# EAGLE schematic RetroLite Rev 1.3 - Main Board (EAGLE 9.6.2)

## Sheet 1 of 14: Connectors
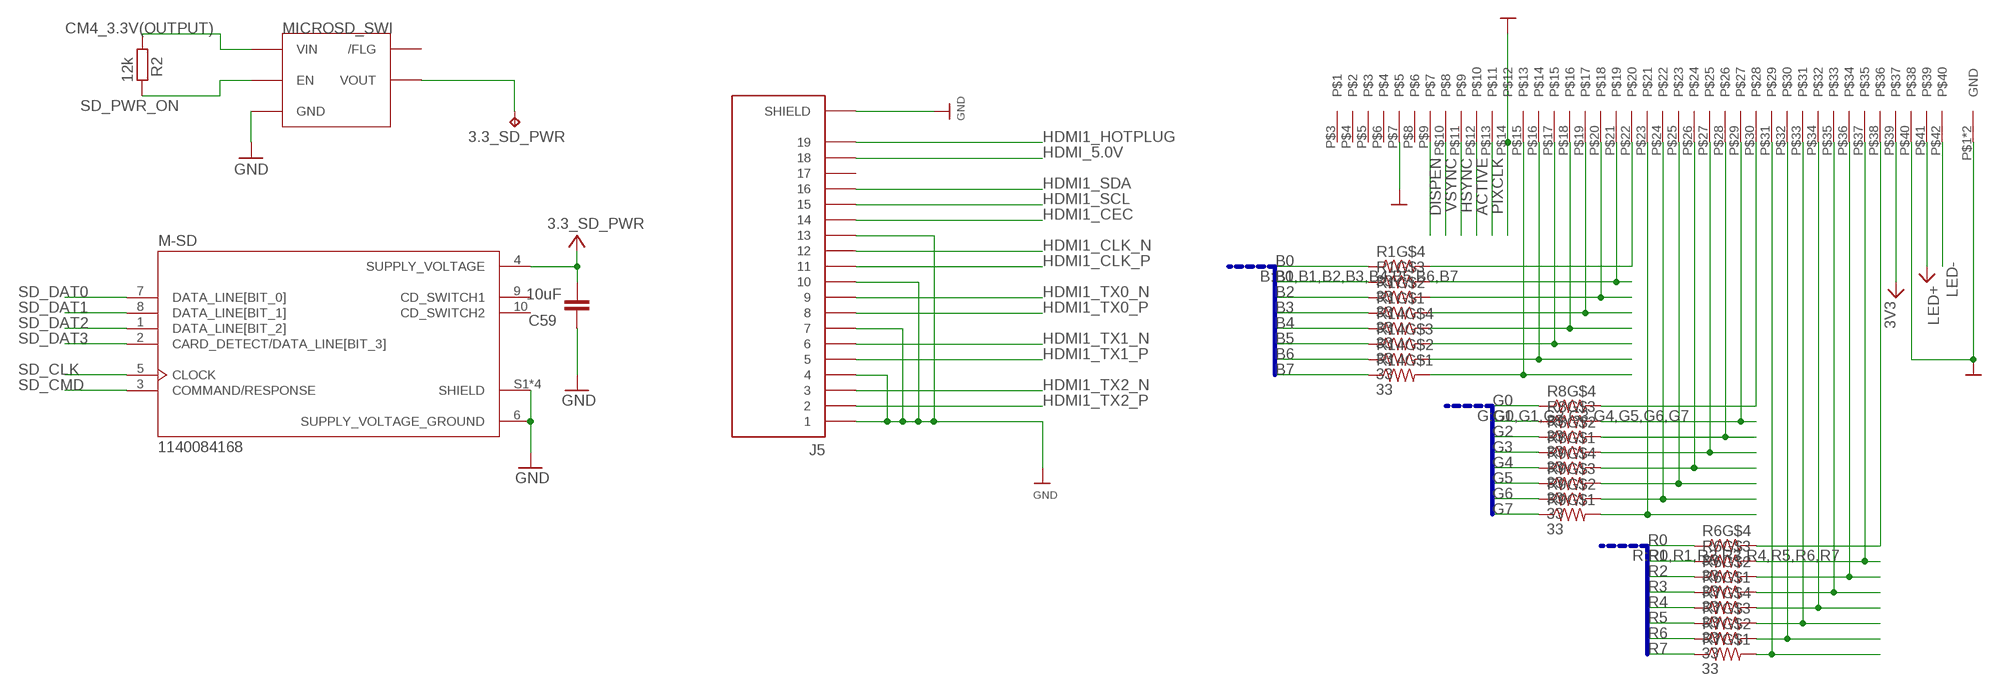
[diagram p0: schematic, sheet 1]

### Parts
3.3_SD_PWR  TPTP07R  [TP07R]
C59  10uF  1.0UF-0805-25V-(+80/-20%)  [0805]
J5  685119136923  [WURTH_685119136923]
M-SD  1140084168  [AMPHENOL_1140084168]
MICROSD_SWI  IC-RT9742  [IC-RT9742]
R1  33  RESISTOR_4PACK_US  [RESPACK_4X0603]
R2  12k  R-EU_R0603  [R0603]
R6  33  RESISTOR_4PACK_US  [RESPACK_4X0603]
R7  33  RESISTOR_4PACK_US  [RESPACK_4X0603]
R8  33  RESISTOR_4PACK_US  [RESPACK_4X0603]
R9  33  RESISTOR_4PACK_US  [RESPACK_4X0603]
R14  33  RESISTOR_4PACK_US  [RESPACK_4X0603]
U3  S62684-402100ALF  [S62684-402100ALF]

### Nets
3.3_SD_PWR: 3.3_SD_PWR.TP C59.2 M-SD.4(SUPPLY_VOLTAGE) MICROSD_SWI.VOUT ; supply symbol labelled VCC
3V3: U3.P$39 ; supply symbol labelled VDD ; also sheet 3,6,9,10,12
ACTIVE: U3.P$12 ; also sheet 3
B0: R1.4 ; also sheet 3
B1: R1.3 ; also sheet 3
B2: R1.2 ; also sheet 3
B3: R1.1 ; also sheet 3
B4: R14.4 ; also sheet 3
B5: R14.3 ; also sheet 3
B6: R14.2 ; also sheet 3
B7: R14.1 ; also sheet 3
CM4_3.3V(OUTPUT): MICROSD_SWI.VIN R2.1 ; also sheet 2,7,8,11,12,13
DISPEN: U3.P$9 ; also sheet 3
G0: R8.4 ; also sheet 3
G1: R8.3 ; also sheet 3
G2: R8.2 ; also sheet 3
G3: R8.1 ; also sheet 3
G4: R9.4 ; also sheet 3
G5: R9.3 ; also sheet 3
G6: R9.2 ; also sheet 3
G7: R9.1 ; also sheet 3
GND: C59.1 J5.1 J5.4 J5.7 J5.10 J5.13 J5.S1(SHIELD) J5.S2(SHIELD) J5.S3(SHIELD) J5.S4(SHIELD) M-SD.6(SUPPLY_VOLTAGE_GROUND) M-SD.S1(SHIELD) M-SD.S2(SHIELD) M-SD.S3(SHIELD) M-SD.S4(SHIELD) MICROSD_SWI.GND U3.P$1(GND) U3.P$2(GND) U3.P$7 U3.P$14 U3.P$40 ; supply symbol labelled AGND ; also sheet 2,3,4,5,6,7,8,9,10,11,12,13,14
HDMI1_CEC: J5.14 ; also sheet 2
HDMI1_CLK_N [HDMI]: J5.12 ; also sheet 2
HDMI1_CLK_P [HDMI]: J5.11 ; also sheet 2
HDMI1_HOTPLUG: J5.19 ; also sheet 2
HDMI1_SCL: J5.15 ; also sheet 2
HDMI1_SDA: J5.16 ; also sheet 2
HDMI1_TX0_N [HDMI]: J5.9 ; also sheet 2
HDMI1_TX0_P [HDMI]: J5.8 ; also sheet 2
HDMI1_TX1_N [HDMI]: J5.6 ; also sheet 2
HDMI1_TX1_P [HDMI]: J5.5 ; also sheet 2
HDMI1_TX2_N [HDMI]: J5.3 ; also sheet 2
HDMI1_TX2_P [HDMI]: J5.2 ; also sheet 2
HDMI_5.0V: J5.18 ; also sheet 4
HSYNC: U3.P$11 ; also sheet 3
LED+: U3.P$41 ; supply symbol labelled 24V ; also sheet 3
LED-: U3.P$42 ; also sheet 3
N$4: R8.5 U3.P$30
N$5: R8.6 U3.P$29
N$6: R8.7 U3.P$28
N$7: R8.8 U3.P$27
N$8: R9.5 U3.P$26
N$9: R9.6 U3.P$25
N$11: R6.5 U3.P$38
N$12: R6.6 U3.P$37
N$13: R6.7 U3.P$36
N$14: R6.8 U3.P$35
N$15: R7.5 U3.P$34
N$16: R7.6 U3.P$33
N$17: R7.7 U3.P$32
N$18: R7.8 U3.P$31
N$19: R9.7 U3.P$24
N$20: R9.8 U3.P$23
N$21: R1.5 U3.P$22
N$22: R1.6 U3.P$21
N$23: R1.7 U3.P$20
N$24: R1.8 U3.P$19
N$25: R14.8 U3.P$15
N$26: R14.7 U3.P$16
N$27: R14.6 U3.P$17
N$28: R14.5 U3.P$18
PIXCLK: U3.P$13 ; also sheet 3
R0: R6.4 ; also sheet 3
R1: R6.3 ; also sheet 3
R2: R6.2 ; also sheet 3
R3: R6.1 ; also sheet 3
R4: R7.4 ; also sheet 3
R5: R7.3 ; also sheet 3
R6: R7.2 ; also sheet 3
R7: R7.1 ; also sheet 3
SD_CLK: M-SD.5(CLOCK) ; also sheet 2
SD_CMD: M-SD.3(COMMAND/RESPONSE) ; also sheet 2
SD_DAT0: M-SD.7(DATA_LINE[BIT_0]) ; also sheet 2
SD_DAT1: M-SD.8(DATA_LINE[BIT_1]) ; also sheet 2
SD_DAT2: M-SD.1(DATA_LINE[BIT_2]) ; also sheet 2
SD_DAT3: M-SD.2(CARD_DETECT/DATA_LINE[BIT_3]) ; also sheet 2
SD_PWR_ON: MICROSD_SWI.EN R2.2 ; also sheet 2
VSYNC: U3.P$10 ; also sheet 3
Unconnected: J5.17 M-SD.9(CD_SWITCH1) M-SD.10(CD_SWITCH2) MICROSD_SWI./FLG U3.P$3 U3.P$4 U3.P$5 U3.P$6 U3.P$8

### Buses
R:R0,R1,R2,R3,R4,R5,R6,R7
G:G0,G1,G2,G3,G4,G5,G6,G7
B:B0,B1,B2,B3,B4,B5,B6,B7

## Sheet 2 of 14: Raspberry Pi
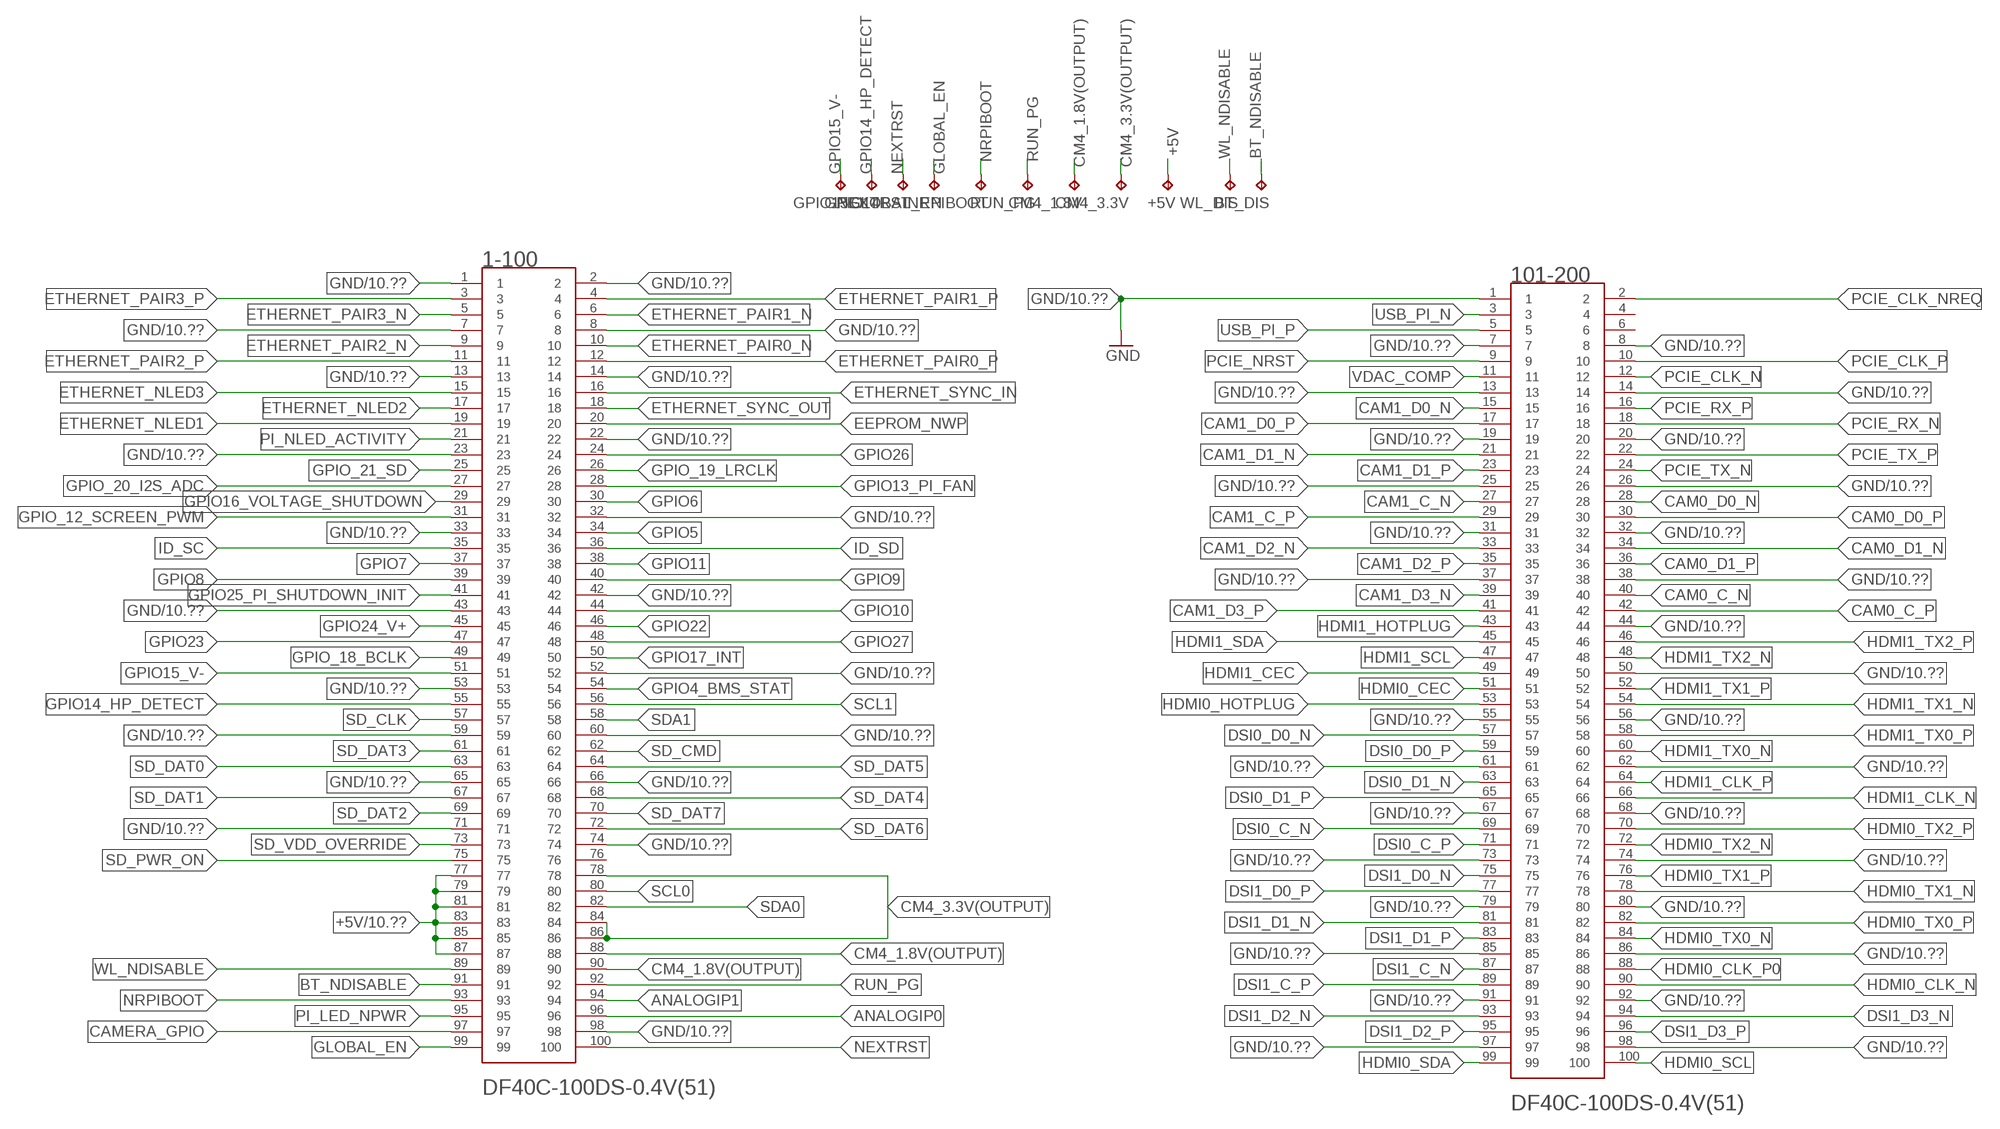
[diagram p1: schematic, sheet 2]

### Parts
1-100  DF40C-100DS-0.4V(51)  [HRS_DF40C-100DS-0.4V(51)]
101-200  DF40C-100DS-0.4V(51)  [HRS_DF40C-100DS-0.4V(51)]
+5V  TPTP07R  [TP07R]
BT_DIS  TPTP07R  [TP07R]
CM4_1.8V  TPTP07R  [TP07R]
CM4_3.3V  TPTP07R  [TP07R]
GLOBAL_EN  TPTP07R  [TP07R]
GPIO14  TPTP07R  [TP07R]
GPIO15  TPTP07R  [TP07R]
NEXTRST  TPTP07R  [TP07R]
NRPIBOOT  TPTP07R  [TP07R]
RUN_PG  TPTP07R  [TP07R]
WL_DIS  TPTP07R  [TP07R]

### Nets
+5V: 1-100.77 1-100.79 1-100.81 1-100.83 1-100.85 1-100.87 +5V.TP ; also sheet 3,4,8,10,11,12,14
ANALOGIP0: 1-100.96
ANALOGIP1: 1-100.94
BT_NDISABLE: 1-100.91 BT_DIS.TP
CAM0_C_N: 101-200.40
CAM0_C_P: 101-200.42
CAM0_D0_N: 101-200.28
CAM0_D0_P: 101-200.30
CAM0_D1_N: 101-200.34
CAM0_D1_P: 101-200.36
CAM1_C_N: 101-200.27
CAM1_C_P: 101-200.29
CAM1_D0_N: 101-200.15
CAM1_D0_P: 101-200.17
CAM1_D1_N: 101-200.21
CAM1_D1_P: 101-200.23
CAM1_D2_N: 101-200.33
CAM1_D2_P: 101-200.35
CAM1_D3_N: 101-200.39
CAM1_D3_P: 101-200.41
CAMERA_GPIO: 1-100.97
CM4_1.8V(OUTPUT): 1-100.88 1-100.90 CM4_1.8V.TP
CM4_3.3V(OUTPUT): 1-100.78 1-100.84 1-100.86 CM4_3.3V.TP ; also sheet 1,7,8,11,12,13
DSI0_C_N: 101-200.69
DSI0_C_P: 101-200.71
DSI0_D0_N: 101-200.57
DSI0_D0_P: 101-200.59
DSI0_D1_N: 101-200.63
DSI0_D1_P: 101-200.65
DSI1_C_N: 101-200.87
DSI1_C_P: 101-200.89
DSI1_D0_N: 101-200.75
DSI1_D0_P: 101-200.77
DSI1_D1_N: 101-200.81
DSI1_D1_P: 101-200.83
DSI1_D2_N: 101-200.93
DSI1_D2_P: 101-200.95
DSI1_D3_N: 101-200.94
DSI1_D3_P: 101-200.96
EEPROM_NWP: 1-100.20
ETHERNET_NLED1: 1-100.19
ETHERNET_NLED2: 1-100.17
ETHERNET_NLED3: 1-100.15
ETHERNET_PAIR0_N: 1-100.10
ETHERNET_PAIR0_P: 1-100.12
ETHERNET_PAIR1_N: 1-100.6
ETHERNET_PAIR1_P: 1-100.4
ETHERNET_PAIR2_N: 1-100.9
ETHERNET_PAIR2_P: 1-100.11
ETHERNET_PAIR3_N: 1-100.5
ETHERNET_PAIR3_P: 1-100.3
ETHERNET_SYNC_IN: 1-100.16
ETHERNET_SYNC_OUT: 1-100.18
GLOBAL_EN: 1-100.99 GLOBAL_EN.TP ; also sheet 11
GND: 1-100.1 1-100.2 1-100.7 1-100.8 1-100.13 1-100.14 1-100.22 1-100.23 1-100.32 1-100.33 1-100.42 1-100.43 1-100.52 1-100.53 1-100.59 1-100.60 1-100.65 1-100.66 1-100.71 1-100.74 1-100.98 101-200.1 101-200.7 101-200.8 101-200.13 101-200.14 101-200.19 101-200.20 101-200.25 101-200.26 101-200.31 101-200.32 101-200.37 101-200.38 101-200.44 101-200.50 101-200.55 101-200.56 101-200.61 101-200.62 101-200.67 101-200.68 101-200.73 101-200.74 101-200.79 101-200.80 101-200.85 101-200.86 101-200.91 101-200.92 101-200.97 101-200.98 ; also sheet 1,3,4,5,6,7,8,9,10,11,12,13,14
GPIO4_BMS_STAT: 1-100.54 ; also sheet 11
GPIO5: 1-100.34
GPIO6: 1-100.30
GPIO7: 1-100.37
GPIO8: 1-100.39
GPIO9: 1-100.40
GPIO10: 1-100.44
GPIO11: 1-100.38
GPIO13_PI_FAN: 1-100.28 ; also sheet 14
GPIO14_HP_DETECT: 1-100.55 GPIO14.TP ; also sheet 8
GPIO15_V-: 1-100.51 GPIO15.TP ; also sheet 11
GPIO16_VOLTAGE_SHUTDOWN: 1-100.29 ; also sheet 11
GPIO17_INT: 1-100.50 ; also sheet 13
GPIO22: 1-100.46
GPIO23: 1-100.47
GPIO24_V+: 1-100.45 ; also sheet 11
GPIO25_PI_SHUTDOWN_INIT: 1-100.41 ; also sheet 11
GPIO26: 1-100.24
GPIO27: 1-100.48
GPIO_12_SCREEN_PWM: 1-100.31 ; also sheet 3
GPIO_18_BCLK: 1-100.49 ; also sheet 8
GPIO_19_LRCLK: 1-100.26 ; also sheet 8
GPIO_20_I2S_ADC: 1-100.27 ; also sheet 8
GPIO_21_SD: 1-100.25 ; also sheet 8
HDMI0_CEC: 101-200.51
HDMI0_CLK_N [HDMI]: 101-200.90 ; also sheet 3
HDMI0_CLK_P0 [HDMI]: 101-200.88 ; also sheet 3
HDMI0_HOTPLUG: 101-200.53
HDMI0_SCL: 101-200.100 ; also sheet 4
HDMI0_SDA: 101-200.99 ; also sheet 4
HDMI0_TX0_N [HDMI]: 101-200.84 ; also sheet 3
HDMI0_TX0_P [HDMI]: 101-200.82 ; also sheet 3
HDMI0_TX1_N [HDMI]: 101-200.78 ; also sheet 3
HDMI0_TX1_P [HDMI]: 101-200.76 ; also sheet 3
HDMI0_TX2_N [HDMI]: 101-200.72 ; also sheet 3
HDMI0_TX2_P [HDMI]: 101-200.70 ; also sheet 3
HDMI1_CEC: 101-200.49 ; also sheet 1
HDMI1_CLK_N [HDMI]: 101-200.66 ; also sheet 1
HDMI1_CLK_P [HDMI]: 101-200.64 ; also sheet 1
HDMI1_HOTPLUG: 101-200.43 ; also sheet 1
HDMI1_SCL: 101-200.47 ; also sheet 1
HDMI1_SDA: 101-200.45 ; also sheet 1
HDMI1_TX0_N [HDMI]: 101-200.60 ; also sheet 1
HDMI1_TX0_P [HDMI]: 101-200.58 ; also sheet 1
HDMI1_TX1_N [HDMI]: 101-200.54 ; also sheet 1
HDMI1_TX1_P [HDMI]: 101-200.52 ; also sheet 1
HDMI1_TX2_N [HDMI]: 101-200.48 ; also sheet 1
HDMI1_TX2_P [HDMI]: 101-200.46 ; also sheet 1
ID_SC: 1-100.35
ID_SD: 1-100.36
NEXTRST: 1-100.100 NEXTRST.TP
NRPIBOOT: 1-100.93 NRPIBOOT.TP
PCIE_CLK_N: 101-200.12
PCIE_CLK_NREQ: 101-200.2
PCIE_CLK_P: 101-200.10
PCIE_NRST: 101-200.9
PCIE_RX_N: 101-200.18
PCIE_RX_P: 101-200.16
PCIE_TX_N: 101-200.24
PCIE_TX_P: 101-200.22
PI_LED_NPWR: 1-100.95 ; also sheet 7
PI_NLED_ACTIVITY: 1-100.21 ; also sheet 7
RUN_PG: 1-100.92 RUN_PG.TP ; also sheet 11
SCL0: 1-100.80
SCL1: 1-100.56 ; also sheet 8,13
SD_CLK: 1-100.57 ; also sheet 1
SD_CMD: 1-100.62 ; also sheet 1
SD_DAT0: 1-100.63 ; also sheet 1
SD_DAT1: 1-100.67 ; also sheet 1
SD_DAT2: 1-100.69 ; also sheet 1
SD_DAT3: 1-100.61 ; also sheet 1
SD_DAT4: 1-100.68
SD_DAT5: 1-100.64
SD_DAT6: 1-100.72
SD_DAT7: 1-100.70
SD_PWR_ON: 1-100.75 ; also sheet 1
SD_VDD_OVERRIDE: 1-100.73
SDA0: 1-100.82
SDA1: 1-100.58 ; also sheet 8,13
USB_PI_N: 101-200.3 ; also sheet 9,10
USB_PI_P: 101-200.5 ; also sheet 9,10
VDAC_COMP: 101-200.11
WL_NDISABLE: 1-100.89 WL_DIS.TP
Unconnected: 1-100.76 101-200.4 101-200.6

## Sheet 3 of 14: HDMI Driver/LED Boost
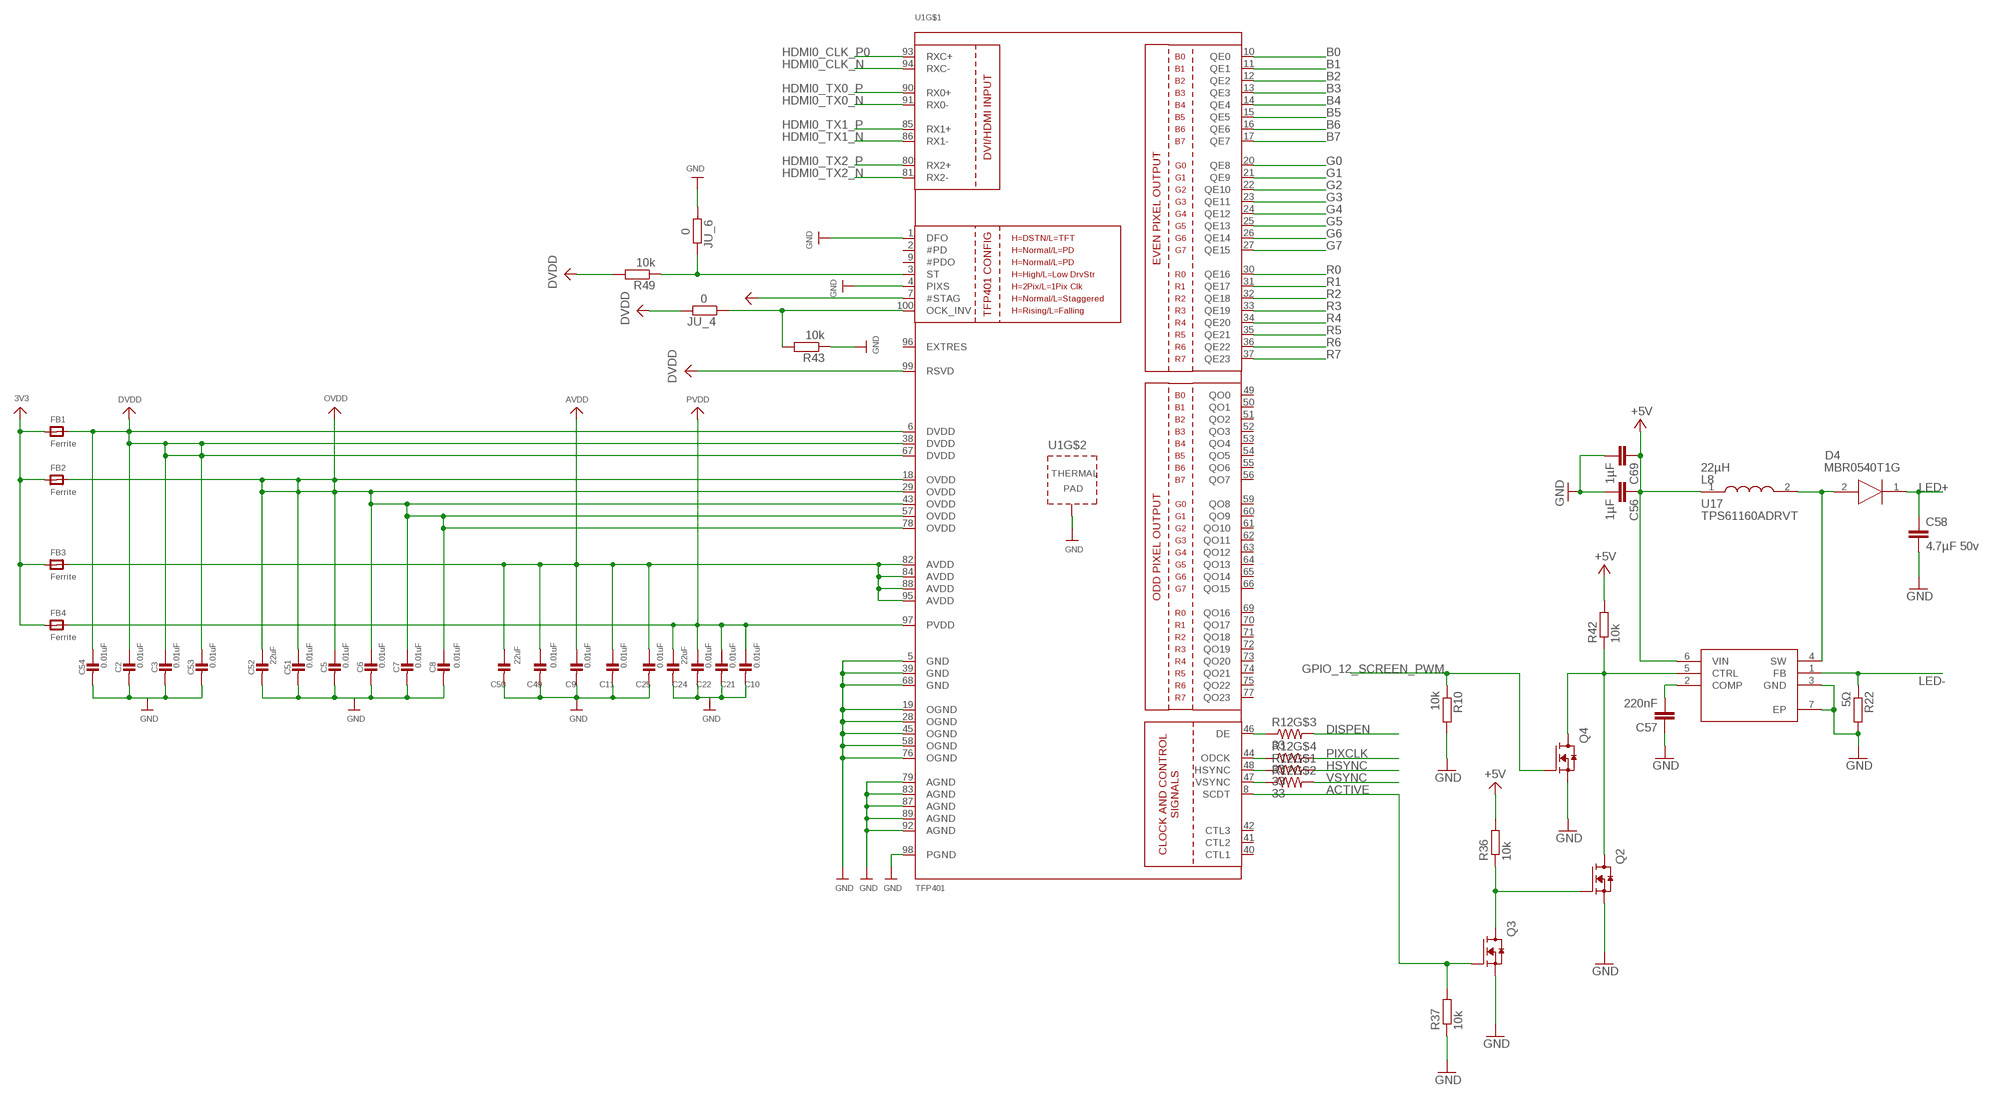
[diagram p2: schematic, sheet 3]

### Parts
C2  0.01uF  CAP_CERAMIC0603_NO  [0603-NO]
C3  0.01uF  CAP_CERAMIC0603_NO  [0603-NO]
C5  0.01uF  CAP_CERAMIC0603_NO  [0603-NO]
C6  0.01uF  CAP_CERAMIC0603_NO  [0603-NO]
C7  0.01uF  CAP_CERAMIC0603_NO  [0603-NO]
C8  0.01uF  CAP_CERAMIC0603_NO  [0603-NO]
C9  0.01uF  CAP_CERAMIC0603_NO  [0603-NO]
C10  0.01uF  CAP_CERAMIC0603_NO  [0603-NO]
C11  0.01uF  CAP_CERAMIC0603_NO  [0603-NO]
C21  0.01uF  CAP_CERAMIC0603_NO  [0603-NO]
C22  0.01uF  CAP_CERAMIC0603_NO  [0603-NO]
C24  22uF  CAP_CERAMIC0603_NO  [0603-NO]
C25  0.01uF  CAP_CERAMIC0603_NO  [0603-NO]
C49  0.01uF  CAP_CERAMIC0603_NO  [0603-NO]
C50  22uF  CAP_CERAMIC0603_NO  [0603-NO]
C51  0.01uF  CAP_CERAMIC0603_NO  [0603-NO]
C52  22uF  CAP_CERAMIC0603_NO  [0603-NO]
C53  0.01uF  CAP_CERAMIC0603_NO  [0603-NO]
C54  0.01uF  CAP_CERAMIC0603_NO  [0603-NO]
C56  1µF  C-EUC0603  [C0603]
C57  220nF  C-EUC0603  [C0603]
C58  4.7µF 50v  C-EUC0805  [C0805]
C69  1µF  C-EUC0603  [C0603]
D4  MBR0540T1G  [SOD3716X135N]
FB1  Ferrite  FERRITE_0805MP  [_0805MP]
FB2  Ferrite  FERRITE_0805MP  [_0805MP]
FB3  Ferrite  FERRITE_0805MP  [_0805MP]
FB4  Ferrite  FERRITE_0805MP  [_0805MP]
JU_4  0  R-EU_R0402  [R0402]
JU_6  0  R-EU_R0402  [R0402]
L8  22µH  VLCF4020T-220MR56  [VLCF4020_1]
Q2  AO3400A  [SOT95P280X125-3N]
Q3  AO3400A  [SOT95P280X125-3N]
Q4  AO3400A  [SOT95P280X125-3N]
R10  10k  R-EU_R0603  [R0603]
R12  33  RESISTOR_4PACK_US  [RESPACK_4X0603]
R22  5Ω  R-EU_R0603  [R0603]
R36  10k  R-EU_R0603  [R0603]
R37  10k  R-EU_R0603  [R0603]
R42  10k  R-EU_R0603  [R0603]
R43  10k  R-EU_R0402  [R0402]
R49  10k  R-EU_R0402  [R0402]
U1  TFP401  [S-PQFP-G100]
U17  TPS61160ADRVT  [SON65P200X200X80-7N]

### Nets
3V3: FB1.1 FB2.1 FB3.1 FB4.1 ; supply symbol labelled VDD ; also sheet 1,6,9,10,12
+5V: C56.1 C69.1 L8.1 R36.2 R42.2 U17.6(VIN) ; supply symbol labelled VDD ; also sheet 2,4,8,10,11,12,14
ACTIVE: Q3.1(G) R37.2 U1.8(SCDT) ; also sheet 1
ASD: R12.3 U1.46(DE)
AVDD: C9.1 C11.1 C25.1 C49.1 C50.1 FB3.2 U1.82(AVDD) U1.84(AVDD) U1.88(AVDD) U1.95(AVDD)
B0: U1.10(QE0) ; also sheet 1
B1: U1.11(QE1) ; also sheet 1
B2: U1.12(QE2) ; also sheet 1
B3: U1.13(QE3) ; also sheet 1
B4: U1.14(QE4) ; also sheet 1
B5: U1.15(QE5) ; also sheet 1
B6: U1.16(QE6) ; also sheet 1
B7: U1.17(QE7) ; also sheet 1
CVB: R12.2 U1.47(VSYNC)
DISPEN: R12.6 ; also sheet 1
DVDD: C2.1 C3.1 C53.1 C54.1 FB1.2 JU_4.2 R49.2 U1.6(DVDD) U1.7(#STAG) U1.38(DVDD) U1.67(DVDD) U1.99(RSVD) ; supply symbol labelled VDDIO
G0: U1.20(QE8) ; also sheet 1
G1: U1.21(QE9) ; also sheet 1
G2: U1.22(QE10) ; also sheet 1
G3: U1.23(QE11) ; also sheet 1
G4: U1.24(QE12) ; also sheet 1
G5: U1.25(QE13) ; also sheet 1
G6: U1.26(QE14) ; also sheet 1
G7: U1.27(QE15) ; also sheet 1
GND: C2.2 C3.2 C5.2 C6.2 C7.2 C8.2 C9.2 C10.2 C11.2 C21.2 C22.2 C24.2 C25.2 C49.2 C50.2 C51.2 C52.2 C53.2 C54.2 C56.2 C57.1 C58.2 C69.2 JU_6.1 Q2.2(S) Q3.2(S) Q4.2(S) R10.2 R22.2 R37.1 R43.1 U1.1(DFO) U1.4(PIXS) U1.5(GND) U1.19(OGND) U1.28(OGND) U1.39(GND) U1.45(OGND) U1.58(OGND) U1.68(GND) U1.76(OGND) U1.79(AGND) U1.83(AGND) U1.87(AGND) U1.89(AGND) U1.92(AGND) U1.98(PGND) U1.P$1(TP) U1.P$2(TP) U1.P$3(TP) U1.P$4(TP) U1.P$5(TP) U1.P$6(TP) U1.P$7(TP) U1.P$8(TP) U1.P$9(TP) U1.P$10(TP) U1.P$11(TP) U1.P$12(TP) U1.P$13(TP) U1.P$14(TP) U1.P$15(TP) U1.P$16(TP) U1.THERMAL(TP) U17.3(GND) U17.7(EP) ; also sheet 1,2,4,5,6,7,8,9,10,11,12,13,14
GPIO_12_SCREEN_PWM: Q4.1(G) R10.1 ; also sheet 2
HDMI0_CLK_N [HDMI]: U1.94(RXC-) ; also sheet 2
HDMI0_CLK_P0 [HDMI]: U1.93(RXC+) ; also sheet 2
HDMI0_TX0_N [HDMI]: U1.91(RX0-) ; also sheet 2
HDMI0_TX0_P [HDMI]: U1.90(RX0+) ; also sheet 2
HDMI0_TX1_N [HDMI]: U1.86(RX1-) ; also sheet 2
HDMI0_TX1_P [HDMI]: U1.85(RX1+) ; also sheet 2
HDMI0_TX2_N [HDMI]: U1.81(RX2-) ; also sheet 2
HDMI0_TX2_P [HDMI]: U1.80(RX2+) ; also sheet 2
HSYNC: R12.8 ; also sheet 1
LED+: C58.1 D4.1(K) ; also sheet 1
LED-: R22.1 U17.1(FB) ; also sheet 1
N$1: C57.2 U17.2(COMP)
N$2: D4.2(A) L8.2 U17.4(SW)
N$40: JU_4.1 R43.2 U1.100(OCK_INV)
N$43: Q2.3(D) Q4.3(D) R42.1 U17.5(CTRL)
N$44: Q2.1(G) Q3.3(D) R36.1
NEW: JU_6.2 R49.1 U1.3(ST)
OVDD: C5.1 C6.1 C7.1 C8.1 C51.1 C52.1 FB2.2 U1.18(OVDD) U1.29(OVDD) U1.43(OVDD) U1.57(OVDD) U1.78(OVDD) ; supply symbol labelled AVDD
PIXCLK: R12.5 ; also sheet 1
PVDD: C10.1 C21.1 C22.1 C24.1 FB4.2 U1.97(PVDD) ; supply symbol labelled AVDD
R0: U1.30(QE16) ; also sheet 1
R1: U1.31(QE17) ; also sheet 1
R2: U1.32(QE18) ; also sheet 1
R3: U1.33(QE19) ; also sheet 1
R4: U1.34(QE20) ; also sheet 1
R5: U1.35(QE21) ; also sheet 1
R6: U1.36(QE22) ; also sheet 1
R7: U1.37(QE23) ; also sheet 1
VSYNC: R12.7 ; also sheet 1
XCV: R12.1 U1.48(HSYNC)
ZXC: R12.4 U1.44(ODCK)
Unconnected: U1.2(#PD) U1.9(#PDO) U1.40(CTL1) U1.41(CTL2) U1.42(CTL3) U1.49(QO0) U1.50(QO1) U1.51(QO2) U1.52(QO3) U1.53(QO4) U1.54(QO5) U1.55(QO6) U1.56(QO7) U1.59(QO8) U1.60(QO9) U1.61(QO10) U1.62(QO11) U1.63(QO12) U1.64(QO13) U1.65(QO14) U1.66(QO15) U1.69(QO16) U1.70(QO17) U1.71(QO18) U1.72(QO19) U1.73(QO20) U1.74(QO21) U1.75(QO22) U1.77(QO23) U1.96(EXTRES)

## Sheet 4 of 14: HDMI Peripherals
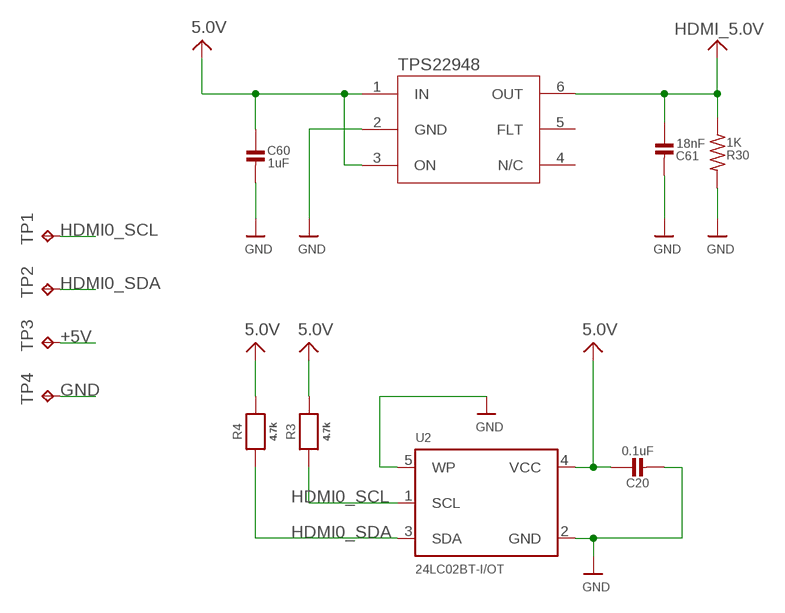
[diagram p3: schematic, sheet 4]

### Parts
C20  0.1uF  CAP_CERAMIC0603_NO  [0603-NO]
C60  1uF  CAP_CERAMIC0603_NO  [0603-NO]
C61  18nF  CAP_CERAMIC0603_NO  [0603-NO]
R3  4.7k  RESISTOR_0603_NOOUT  [0603-NO]
R4  4.7k  RESISTOR_0603_NOOUT  [0603-NO]
R30  1K  R-US_R0603  [R0603]
TP1  TPTP07R  [TP07R]
TP2  TPTP07R  [TP07R]
TP3  TPTP07R  [TP07R]
TP4  TPTP07R  [TP07R]
U2  24LC02BT-I/OT  EEPROM_I2C_MCP24AA32  [SOT23-5]
U15  TPS22948  [SOT65P210X110-6N]

### Nets
+5V: C20.1 C60.1 R3.2 R4.2 TP3.TP U2.4(VCC) U15.1(IN) U15.3(ON) ; supply symbol labelled 5.0V ; also sheet 2,3,8,10,11,12,14
GND: C20.2 C60.2 C61.2 R30.2 TP4.TP U2.2(GND) U2.5(WP) U15.2(GND) ; also sheet 1,2,3,5,6,7,8,9,10,11,12,13,14
HDMI0_SCL: R3.1 TP1.TP U2.1(SCL) ; also sheet 2
HDMI0_SDA: R4.1 TP2.TP U2.3(SDA) ; also sheet 2
HDMI_5.0V: C61.1 R30.1 U15.6(OUT) ; supply symbol labelled 5.0V ; also sheet 1
Unconnected: U15.4(N/C) U15.5(FLT)

## Sheet 5 of 14: BQ24924i
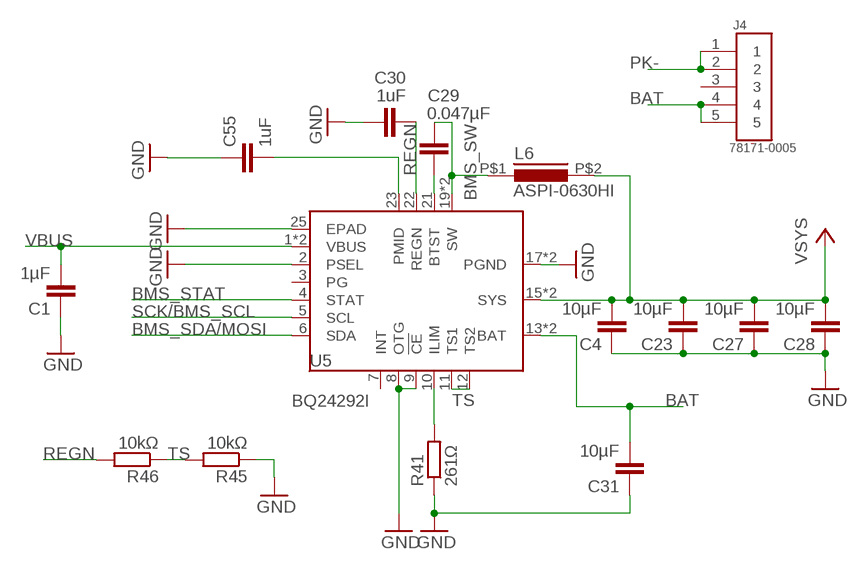
[diagram p4: schematic, sheet 5]

### Parts
C1  1µF  C-EUC0805  [C0805]
C4  10µF  C-EUC0805  [C0805]
C23  10µF  C-EUC0805  [C0805]
C27  10µF  C-EUC0805  [C0805]
C28  10µF  C-EUC0805  [C0805]
C29  0.047µF  C-EUC0603  [C0603]
C30  1uF  C-EUC0603  [C0603]
C31  10µF  C-EUC0805  [C0805]
C55  1uF  C-EUC0603  [C0603]
J4  78171-0005  [MOLEX_78171-0005]
L6  ASPI-0630HI  [ASPI-0630HI]
R41  261Ω  R-EU_R0603  [R0603]
R45  10kΩ  R-EU_R0603  [R0603]
R46  10kΩ  R-EU_R0603  [R0603]
U5  BQ24292I  [QFN50P400X400X100-25N]

### Nets
BAT: C31.2 J4.4 J4.5 U5.13(BAT) U5.14(BAT) ; also sheet 13
BMS_SDA/MOSI: U5.6(SDA) ; also sheet 11
BMS_STAT: U5.4(STAT) ; also sheet 6,11
BMS_SW: C29.1 L6.P$1 U5.19(SW) U5.20(SW)
GND: C1.1 C4.1 C23.1 C27.1 C28.1 C30.1 C31.1 C55.1 R41.1 R45.1 U5.2(PSEL) U5.8(OTG) U5.9(!CE) U5.17(PGND) U5.18(PGND) U5.25(EPAD) ; also sheet 1,2,3,4,6,7,8,9,10,11,12,13,14
N$29: C55.2 U5.23(PMID)
N$33: C29.2 U5.21(BTST)
N$34: R41.2 U5.10(ILIM)
PK-: J4.1 J4.2 ; also sheet 13
REGN: C30.2 R46.2 U5.22(REGN)
SCK/BMS_SCL: U5.5(SCL) ; also sheet 11
TS: R45.2 R46.1 U5.11(TS1) U5.12(TS2)
VBUS: C1.2 U5.1(VBUS) U5.24(VBUS) ; also sheet 6
VSYS: C4.2 C23.2 C27.2 C28.2 L6.P$2 U5.15(SYS) U5.16(SYS) ; also sheet 11,12
Unconnected: J4.3 U5.3(PG) U5.7(INT)

## Sheet 6 of 14: USB-C: IP2721
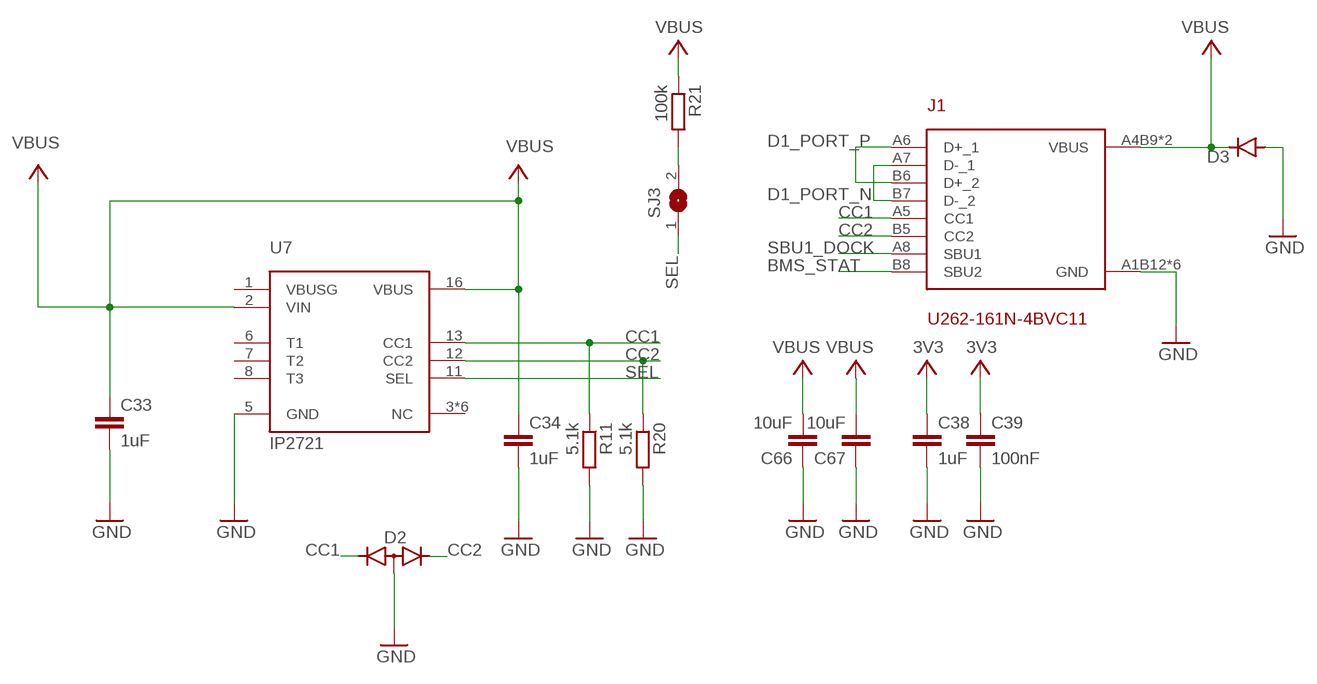
[diagram p5: schematic, sheet 6]

### Parts
C33  1uF  C-EUC0805  [C0805]
C34  1uF  C-EUC0805  [C0805]
C38  1uF  C-EUC0603  [C0603]
C39  100nF  C-EUC0603  [C0603]
C66  10uF  C-EUC0805  [C0805]
C67  10uF  C-EUC0805  [C0805]
D2  ESDA25W  [SOT65P210X110-3N]
D3  ESDA25P35-1U1M  [ESDA8P801U1M]
J1  U262-161N-4BVC11  [U262-161N-4BVC11]
R11  5.1k  R-EU_R0603  [R0603]
R20  5.1k  R-EU_R0603  [R0603]
R21  100k  R-EU_R0603  [R0603]
SJ3  SOLDERJUMPER  [SOLDERJUMPER_ARROW_NOPASTE]
U7  IP2721  [TSSOP-16]

### Nets
3V3: C38.1 C39.1 ; supply symbol labelled VCC ; also sheet 1,3,9,10,12
BMS_STAT: J1.B8(SBU2) ; also sheet 5,11
CC1: D2.1(K2) J1.A5(CC1) R11.1 U7.13(CC1)
CC2: D2.2(K1) J1.B5(CC2) R20.1 U7.12(CC2)
D1_PORT_N [USB 2.0 Differential Pair]: J1.A7(D-_1) J1.B7(D-_2) ; also sheet 9,10
D1_PORT_P [USB 2.0 Differential Pair]: J1.A6(D+_1) J1.B6(D+_2) ; also sheet 9,10
GND: C33.2 C34.2 C38.2 C39.2 C66.1 C67.1 D2.3(A) D3.1(A) J1.A1B12(GND) J1.B1A12(GND) J1.SHIELD_1(GND) J1.SHIELD_2(GND) J1.SHIELD_3(GND) J1.SHIELD_4(GND) R11.2 R20.2 U7.5(GND) ; also sheet 1,2,3,4,5,7,8,9,10,11,12,13,14
N$37: R21.2 SJ3.2
SBU1_DOCK: J1.A8(SBU1) ; also sheet 10
SEL: SJ3.1 U7.11(SEL)
VBUS: C33.1 C34.1 C66.2 C67.2 D3.2(C) J1.A4B9(VBUS) J1.B4A9(VBUS) R21.1 U7.2(VIN) U7.16(VBUS) ; supply symbol labelled VCC ; also sheet 5
Unconnected: U7.1(VBUSG) U7.3(NC) U7.4(NC) U7.6(T1) U7.7(T2) U7.8(T3) U7.9(NC) U7.10(NC) U7.14(NC) U7.15(NC)

## Sheet 7 of 14: LEDs
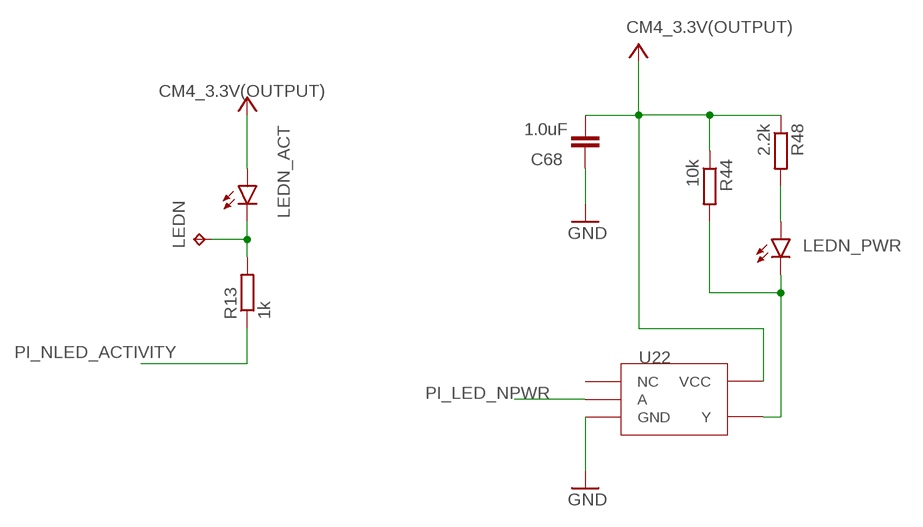
[diagram p6: schematic, sheet 7]

### Parts
C68  1.0uF  1.0UF-0603-16V-10%  [0603]
LEDN  TPTP07R  [TP07R]
LEDN_ACT  LEDSML0603  [SML0603]
LEDN_PWR  LEDSML0603  [SML0603]
R13  1k  R-EU_R0603  [R0603]
R44  10k  R-EU_R0603  [R0603]
R48  2.2k  R-EU_R0603  [R0603]
U22  BUF-74LVC1G07  [BUF-74LVC1G07]

### Nets
CM4_3.3V(OUTPUT): C68.2 LEDN_ACT.A R44.1 R48.1 U22.VCC ; supply symbol labelled VCC ; also sheet 1,2,8,11,12,13
GND: C68.1 U22.GND ; also sheet 1,2,3,4,5,6,8,9,10,11,12,13,14
N$3: LEDN.TP LEDN_ACT.C R13.2
N$31: LEDN_PWR.A R48.2
N$51: LEDN_PWR.C R44.2 U22.Y
PI_LED_NPWR: U22.A ; also sheet 2
PI_NLED_ACTIVITY: R13.1 ; also sheet 2
Unconnected: U22.NC

## Sheet 8 of 14: Amplifier: WM8960 HAT
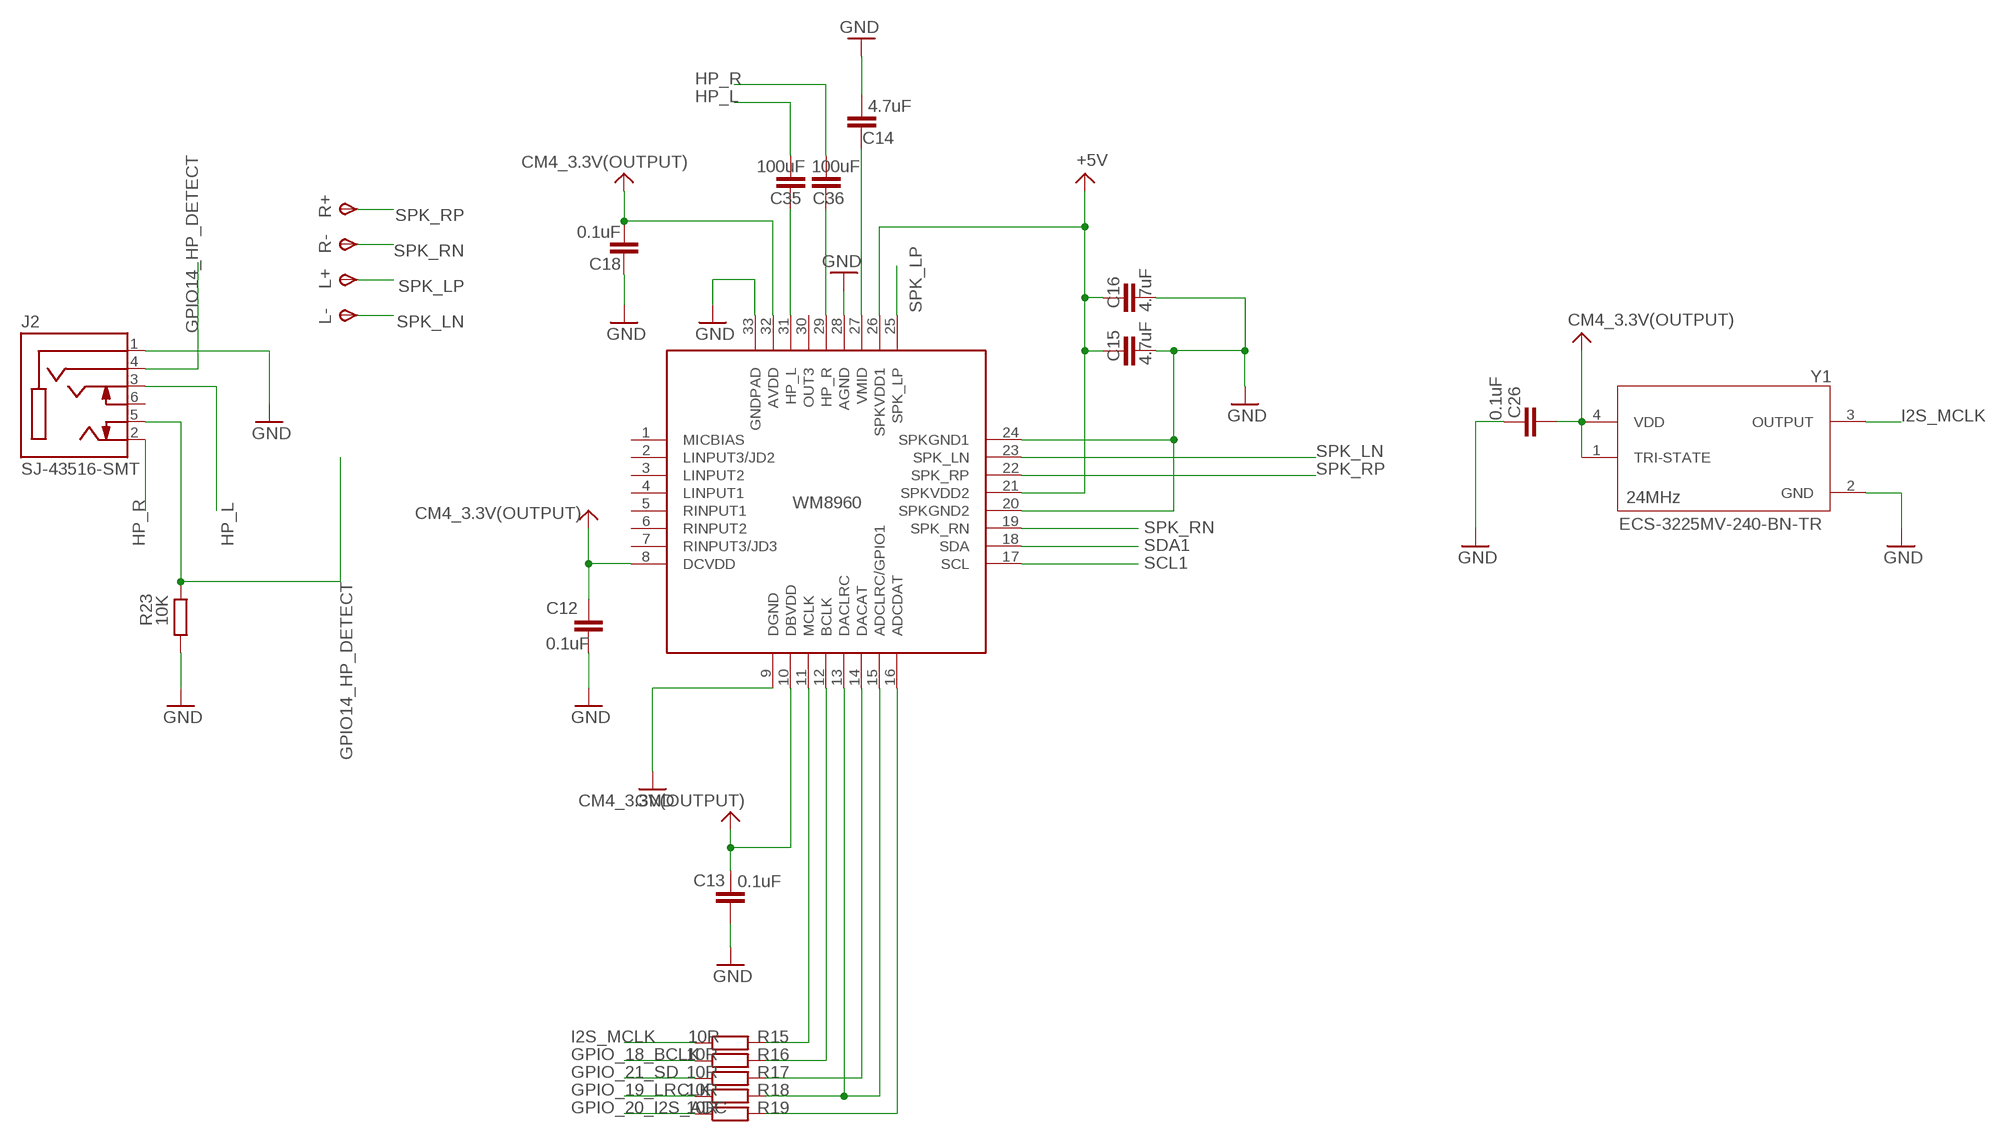
[diagram p7: schematic, sheet 8]

### Parts
C12  0.1uF  C-EUC0603  [C0603]
C13  0.1uF  C-EUC0603  [C0603]
C14  4.7uF  C-EUC0603  [C0603]
C15  4.7uF  C-EUC0603  [C0603]
C16  4.7uF  C-EUC0603  [C0603]
C18  0.1uF  C-EUC0603  [C0603]
C26  0.1uF  C-EUC0603  [C0603]
C35  100uF  C-EUC1206  [C1206]
C36  100uF  C-EUC1206  [C1206]
J2  SJ-43516-SMT  [CUI_SJ-43516-SMT]
L+  TPSTP09SQ  [TP09SQ]
L-  TPSTP09SQ  [TP09SQ]
R15  10R  R-EU_R0603  [R0603]
R16  10R  R-EU_R0603  [R0603]
R17  10R  R-EU_R0603  [R0603]
R18  10R  R-EU_R0603  [R0603]
R19  10R  R-EU_R0603  [R0603]
R23  10K  R-EU_R0603  [R0603]
R+  TPSTP09SQ  [TP09SQ]
R-  TPSTP09SQ  [TP09SQ]
U6  WM8960  [QFN50P500X500X100-33N]
Y1  ECS-3225MV-240-BN-TR  [OSC_ECS-2333-160-BN-TR]

### Nets
+5V: C15.1 C16.1 U6.21(SPKVDD2) U6.26(SPKVDD1) ; supply symbol labelled VDD ; also sheet 2,3,4,10,11,12,14
ADC: R19.2 U6.16(ADCDAT)
BCLK: R16.2 U6.12(BCLK)
CM4_3.3V(OUTPUT): C12.1 C13.1 C18.2 C26.2 U6.8(DCVDD) U6.10(DBVDD) U6.32(AVDD) Y1.1(TRI-STATE) Y1.4(VDD) ; supply symbol labelled VDD ; also sheet 1,2,7,11,12,13
DAC: R17.2 U6.14(DACAT)
GND: C12.2 C13.2 C14.2 C15.2 C16.2 C18.1 C26.1 J2.1(SLEEVE) R23.2 U6.9(DGND) U6.20(SPKGND2) U6.24(SPKGND1) U6.28(AGND) U6.33(GNDPAD) Y1.2(GND) ; also sheet 1,2,3,4,5,6,7,9,10,11,12,13,14
GPIO14_HP_DETECT: J2.4(RING2) J2.5(TIP_SWITCH) R23.1 ; also sheet 2
GPIO_18_BCLK: R16.1 ; also sheet 2
GPIO_19_LRCLK: R18.1 ; also sheet 2
GPIO_20_I2S_ADC: R19.1 ; also sheet 2
GPIO_21_SD: R17.1 ; also sheet 2
HP_L: C35.2 J2.3(RING1)
HP_R: C36.2 J2.2(TIP)
I2S_MCLK: R15.1 Y1.3(OUTPUT)
MCLK: R15.2 U6.11(MCLK)
N$10: C14.1 U6.27(VMID)
N$35: C35.1 U6.31(HP_L)
N$39: C36.1 U6.29(HP_R)
SCL1: U6.17(SCL) ; also sheet 2,13
SDA1: U6.18(SDA) ; also sheet 2,13
SPK_LN: L-.TP(PP) U6.23(SPK_LN)
SPK_LP: L+.TP(PP) U6.25(SPK_LP)
SPK_RN: R-.TP(PP) U6.19(SPK_RN)
SPK_RP: R+.TP(PP) U6.22(SPK_RP)
WS: R18.2 U6.13(DACLRC) U6.15(ADCLRC/GPIO1)
Unconnected: J2.6(RING_SWITCH) U6.1(MICBIAS) U6.2(LINPUT3/JD2) U6.3(LINPUT2) U6.4(LINPUT1) U6.5(RINPUT1) U6.6(RINPUT2) U6.7(RINPUT3/JD3) U6.30(OUT3)

### Notes on the sheet
- 0.1uF
- 24MHz
- WM8960

## Sheet 9 of 14: USB Hub
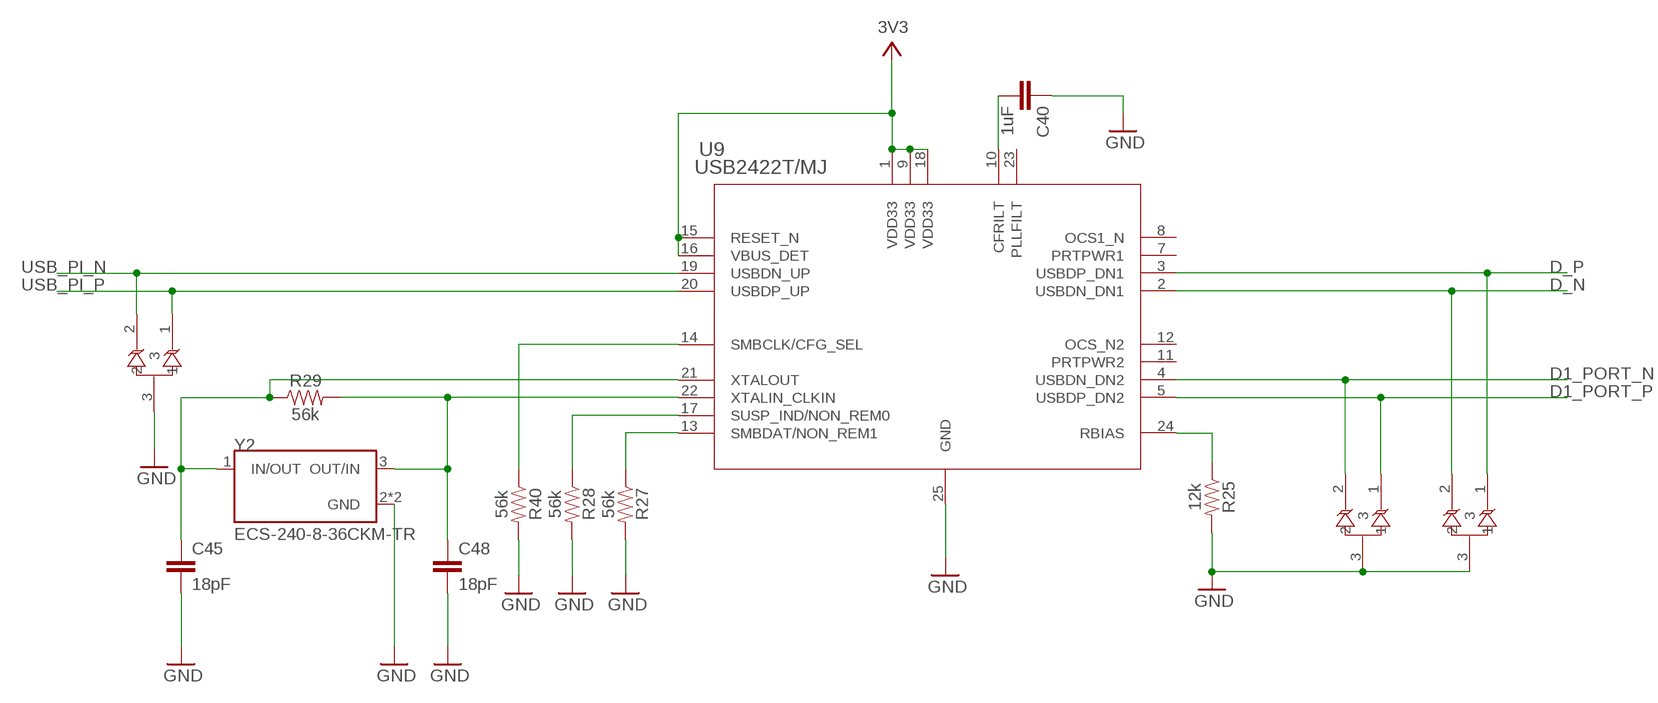
[diagram p8: schematic, sheet 9]

### Parts
C40  1uF  C-EUC0603  [C0603]
C45  18pF  C-EUC0603  [C0603]
C48  18pF  C-EUC0603  [C0603]
R25  12k  100KOHM-0603-1/10W-1%  [0603]
R27  56k  100KOHM-0603-1/10W-1%  [0603]
R28  56k  100KOHM-0603-1/10W-1%  [0603]
R29  56k  100KOHM-0603-1/10W-1%  [0603]
R40  56k  100KOHM-0603-1/10W-1%  [0603]
U9  USB2422T/MJ  [SQFN24_4X4MC_MCH]
U10  RCLAMP0582BQTCT  [SC75-3L_SEM]
U12  RCLAMP0582BQTCT  [SC75-3L_SEM]
U13  RCLAMP0582BQTCT  [SC75-3L_SEM]
Y2  ECS-240-8-36CKM-TR  [XTAL_ECS-160-10-36-JGN-TR]

### Nets
3V3: U9.1(VDD33) U9.9(VDD33) U9.15(RESET_N) U9.16(VBUS_DET) U9.18(VDD33) ; supply symbol labelled VCC ; also sheet 1,3,6,10,12
D1_PORT_N [USB 2.0 Differential Pair]: U9.4(USBDN_DN2) U10.2 ; also sheet 6,10
D1_PORT_P [USB 2.0 Differential Pair]: U9.5(USBDP_DN2) U10.1 ; also sheet 6,10
D_N [USB 2.0 Differential Pair]: U9.2(USBDN_DN1) U12.2 ; also sheet 10
D_P [USB 2.0 Differential Pair]: U9.3(USBDP_DN1) U12.1 ; also sheet 10
GND: C40.1 C45.2 C48.2 R25.2 R27.2 R28.2 R40.2 U9.25(GND) U10.3 U12.3 U13.3 Y2.2(GND) Y2.4(GND) ; also sheet 1,2,3,4,5,6,7,8,10,11,12,13,14
N$36: R40.1 U9.14(SMBCLK/CFG_SEL)
N$59: R25.1 U9.24(RBIAS)
N$67: C40.2 U9.10(CFRILT)
N$68: R28.1 U9.17(SUSP_IND/NON_REM0)
N$69: R27.1 U9.13(SMBDAT/NON_REM1)
N$70: C45.1 R29.1 U9.21(XTALOUT) Y2.1(IN/OUT)
N$71: C48.1 R29.2 U9.22(XTALIN_CLKIN) Y2.3(OUT/IN)
USB_PI_N: U9.19(USBDN_UP) U13.2 ; also sheet 2,10
USB_PI_P: U9.20(USBDP_UP) U13.1 ; also sheet 2,10
Unconnected: U9.7(PRTPWR1) U9.8(OCS1_N) U9.11(PRTPWR2) U9.12(OCS_N2) U9.23(PLLFILT)

## Sheet 10 of 14: Controller
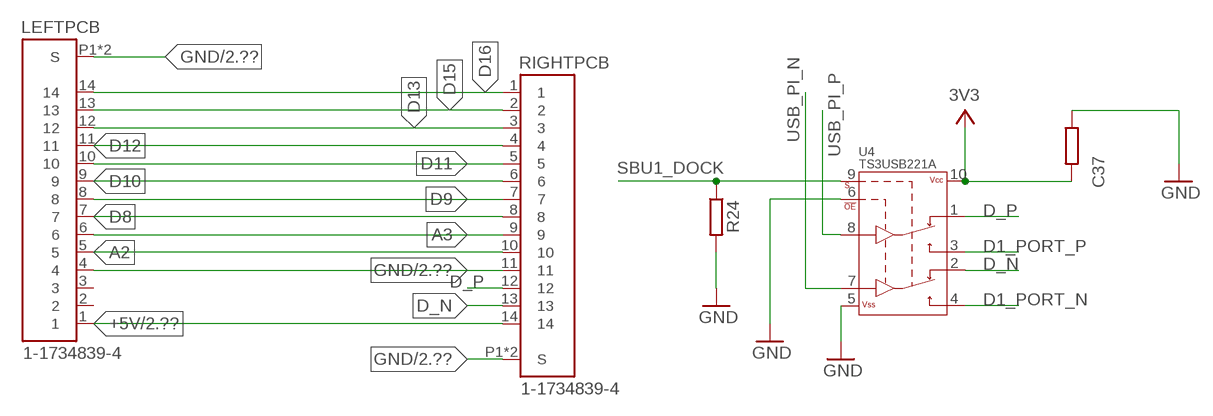
[diagram p9: schematic, sheet 10]

### Parts
C37  0.1uF  R-EU_R0402  [R0402]
LEFTPCB  1-1734839-4  [TE_1-1734839-4]
R24  100K  R-EU_R0402  [R0402]
RIGHTPCB  1-1734839-4  [TE_1-1734839-4]
U4  TS3USB221A  [QFN-10-RSE]

### Nets
3V3: C37.2 U4.10(VCC) ; supply symbol labelled VCC ; also sheet 1,3,6,9,12
+5V: LEFTPCB.1 RIGHTPCB.14 ; also sheet 2,3,4,8,11,12,14
A2: LEFTPCB.5 RIGHTPCB.10
A3: LEFTPCB.6 RIGHTPCB.9
D1_PORT_N [USB 2.0 Differential Pair]: U4.4(2D-) ; also sheet 6,9
D1_PORT_P [USB 2.0 Differential Pair]: U4.3(2D+) ; also sheet 6,9
D8: LEFTPCB.7 RIGHTPCB.8
D9: LEFTPCB.8 RIGHTPCB.7
D10: LEFTPCB.9 RIGHTPCB.6
D11: LEFTPCB.10 RIGHTPCB.5
D12: LEFTPCB.11 RIGHTPCB.4
D13: LEFTPCB.12 RIGHTPCB.3
D15: LEFTPCB.13 RIGHTPCB.2
D16: LEFTPCB.14 RIGHTPCB.1
D_N [USB 2.0 Differential Pair]: RIGHTPCB.13 U4.2(1D-) ; also sheet 9
D_P [USB 2.0 Differential Pair]: RIGHTPCB.12 U4.1(1D+) ; also sheet 9
GND: C37.1 LEFTPCB.4 LEFTPCB.P1(S) LEFTPCB.P2(S) R24.2 RIGHTPCB.11 RIGHTPCB.P1(S) RIGHTPCB.P2(S) U4.5(VSS) U4.6(!OE) ; also sheet 1,2,3,4,5,6,7,8,9,11,12,13,14
SBU1_DOCK: R24.1 U4.9(S) ; also sheet 6
USB_PI_N: U4.7(D-) ; also sheet 2,9
USB_PI_P: U4.8(D+) ; also sheet 2,9
Unconnected: LEFTPCB.2 LEFTPCB.3

## Sheet 11 of 14: ATtiny
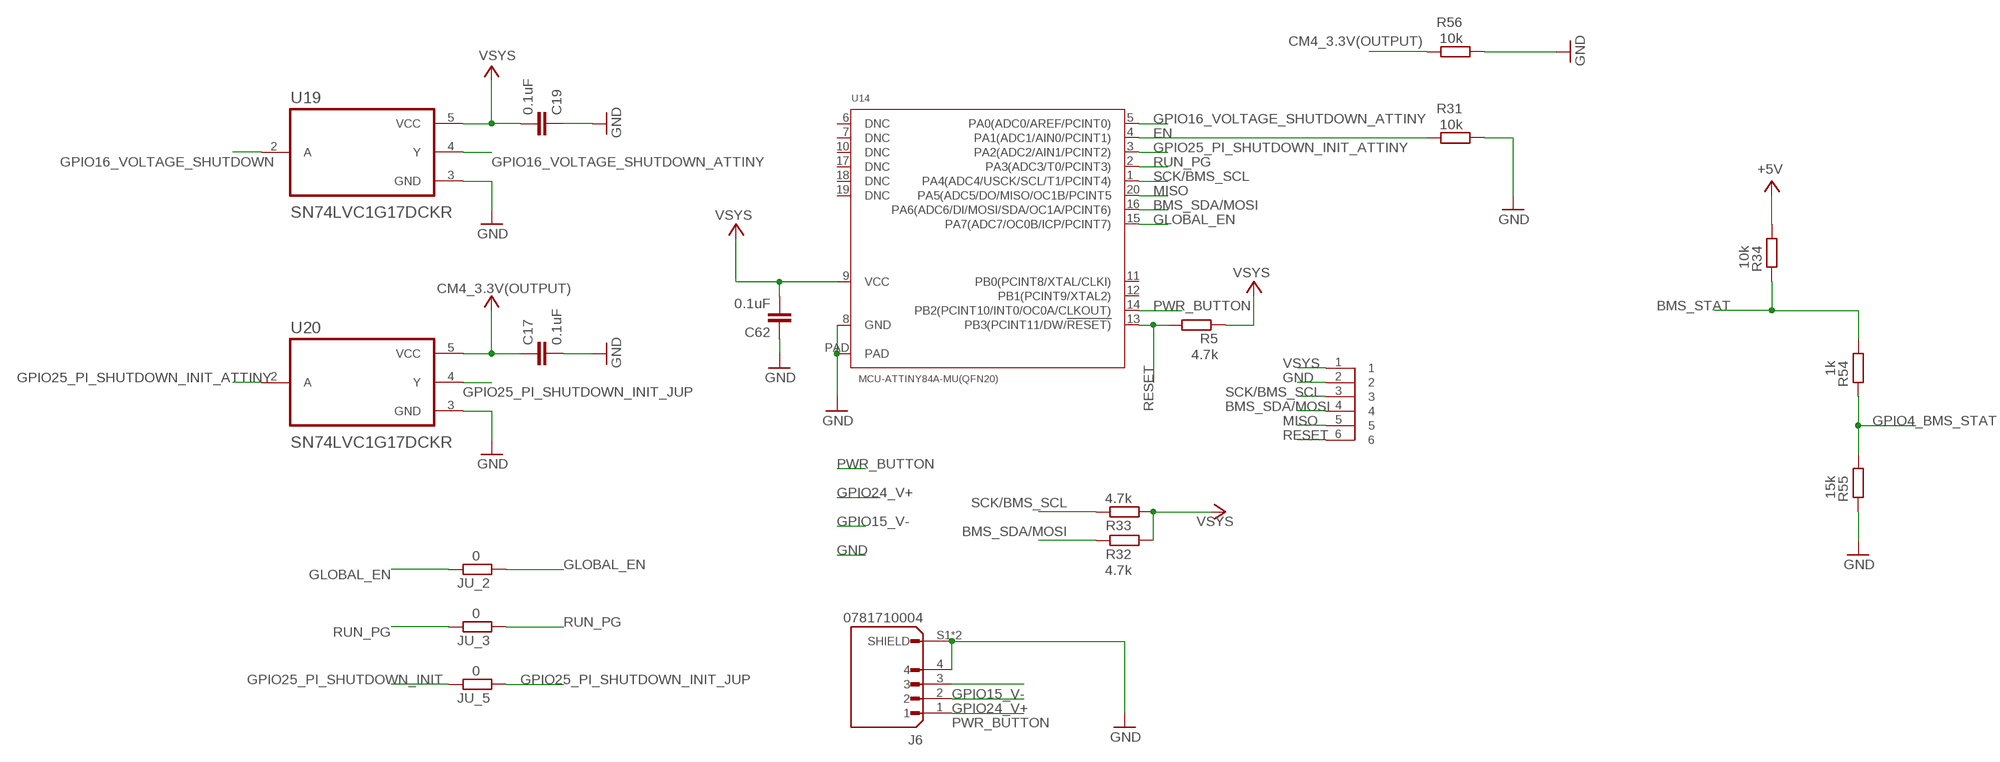
[diagram p10: schematic, sheet 11]

### Parts
C17  0.1uF  C-EUC0603  [C0603]
C19  0.1uF  C-EUC0603  [C0603]
C62  0.1uF  C-EUC0603  [C0603]
J6  0781710004  [MOLEX_0781710004]
JU_2  0  R-EU_R0402  [R0402]
JU_3  0  R-EU_R0402  [R0402]
JU_5  0  R-EU_R0402  [R0402]
R5  4.7k  R-EU_R0603  [R0603]
R31  10k  R-EU_R0603  [R0603]
R32  4.7k  R-EU_R0603  [R0603]
R33  4.7k  R-EU_R0603  [R0603]
R34  10k  R-EU_R0603  [R0603]
R54  1k  R-EU_R0603  [R0603]
R55  15k  R-EU_R0603  [R0603]
R56  10k  R-EU_R0603  [R0603]
U14  MCU-ATTINY84A-MU(QFN20)  [QFN20G-0.5-4X4MM]
U19  SN74LVC1G17DCKR  [SOT65P210X110-5N]
U20  SN74LVC1G17DCKR  [SOT65P210X110-5N]
U$29  1MM_PIC_PROGRAMING_HEADER  [1MM_PIC-PROGRAMING_HEADER]

### Nets
+5V: R34.1 ; supply symbol labelled VSYS ; also sheet 2,3,4,8,10,12,14
BMS_SDA/MOSI: R32.2 U14.16(PA6(ADC6/DI/MOSI/SDA/OC1A/PCINT6)) U$29.4 ; also sheet 5
BMS_STAT: R34.2 R54.1 ; also sheet 5,6
CM4_3.3V(OUTPUT): C17.1 R56.2 U20.5(VCC) ; supply symbol labelled VSYS ; also sheet 1,2,7,8,12,13
EN: R31.2 U14.4(PA1(ADC1/AIN0/PCINT1)) ; also sheet 12
GLOBAL_EN: JU_2.1 JU_2.2 U14.15(PA7(ADC7/OC0B/ICP/PCINT7)) ; also sheet 2
GND: C17.2 C19.1 C62.1 J6.4 J6.S1(SHIELD) J6.S2(SHIELD) R31.1 R55.2 R56.1 U14.8(GND) U14.PAD U19.3(GND) U20.3(GND) U$29.2 ; also sheet 1,2,3,4,5,6,7,8,9,10,12,13,14
GPIO4_BMS_STAT: R54.2 R55.1 ; also sheet 2
GPIO15_V-: J6.3 ; also sheet 2
GPIO16_VOLTAGE_SHUTDOWN: U19.2(A) ; also sheet 2
GPIO16_VOLTAGE_SHUTDOWN_ATTINY: U14.5(PA0(ADC0/AREF/PCINT0)) U19.4(Y)
GPIO24_V+: J6.2 ; also sheet 2
GPIO25_PI_SHUTDOWN_INIT: JU_5.2 ; also sheet 2
GPIO25_PI_SHUTDOWN_INIT_ATTINY: U14.3(PA2(ADC2/AIN1/PCINT2)) U20.2(A)
GPIO25_PI_SHUTDOWN_INIT_JUP: JU_5.1 U20.4(Y)
MISO: U14.20(PA5(ADC5/DO/MISO/OC1B/PCINT5) U$29.5
PWR_BUTTON: J6.1 U14.14(PB2(PCINT10/INT0/OC0A/CLKOUT))
RESET: R5.2 U14.13(PB3(PCINT11/DW/!RESET)) U$29.6
RUN_PG: JU_3.1 JU_3.2 U14.2(PA3(ADC3/T0/PCINT3)) ; also sheet 2
SCK/BMS_SCL: R33.2 U14.1(PA4(ADC4/USCK/SCL/T1/PCINT4)) U$29.3 ; also sheet 5
VSYS: C19.2 C62.2 R5.1 R32.1 R33.1 U14.9(VCC) U19.5(VCC) U$29.1 ; also sheet 5,12
Unconnected: U14.6(DNC) U14.7(DNC) U14.10(DNC) U14.11(PB0(PCINT8/XTAL/CLKI)) U14.12(PB1(PCINT9/XTAL2)) U14.17(DNC) U14.18(DNC) U14.19(DNC)

## Sheet 12 of 14: Regulators
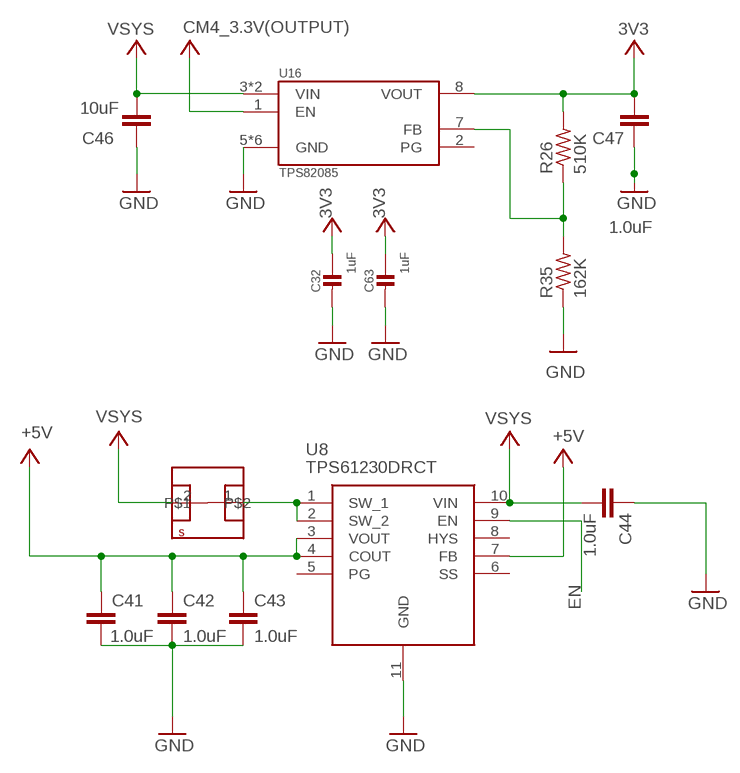
[diagram p11: schematic, sheet 12]

### Parts
C32  1uF  CAP_CERAMIC0603_NO  [0603-NO]
C41  1.0uF  1.0UF-0603-16V-10%  [0603]
C42  1.0uF  1.0UF-0603-16V-10%  [0603]
C43  1.0uF  1.0UF-0603-16V-10%  [0603]
C44  1.0uF  1.0UF-0603-16V-10%  [0603]
C46  10uF  1.0UF-0805-25V-(+80/-20%)  [0805]
C47  1.0uF  1.0UF-0603-16V-10%  [0603]
C63  1uF  CAP_CERAMIC0603_NO  [0603-NO]
R26  510K  R-US_R0603  [R0603]
R35  162K  R-US_R0603  [R0603]
U8  TPS61230DRCT  [SON50P300X300X100-11N]
U16  TPS82085  [SON65P280X300X133-9N]
U18  INDUCTOR_SMALL  [INDUCTOR_SMALL]

### Nets
3V3: C32.1 C47.2 C63.1 R26.2 U16.8(VOUT) ; supply symbol labelled VCC ; also sheet 1,3,6,9,10
+5V: C41.1 C42.1 C43.1 U8.3(VOUT) U8.4(COUT) U8.7(FB) ; supply symbol labelled VSYS ; also sheet 2,3,4,8,10,11,14
CM4_3.3V(OUTPUT): U16.1(EN) ; supply symbol labelled VCC ; also sheet 1,2,7,8,11,13
EN: U8.9(EN) ; also sheet 11
GND: C32.2 C41.2 C42.2 C43.2 C44.1 C46.1 C47.1 C63.2 R35.1 U8.11(GND) U16.5(GND) U16.6(GND) U16.9(GND) U16.P$1(GND) U16.P$2(GND) U16.P$3(GND) ; also sheet 1,2,3,4,5,6,7,8,9,10,11,13,14
N$58: U8.1(SW_1) U8.2(SW_2) U18.1
N$60: R26.1 R35.2 U16.7(FB)
VSYS: C44.2 C46.2 U8.10(VIN) U16.3(VIN) U16.4(VIN) U18.2 ; supply symbol labelled VCC ; also sheet 5,11
Unconnected: U8.5(PG) U8.6(SS) U8.8(HYS) U16.2(PG)

## Sheet 13 of 14: Fuel Gauge
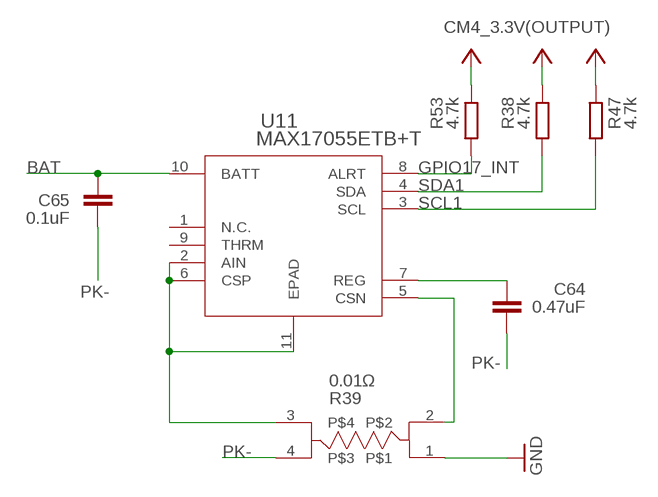
[diagram p12: schematic, sheet 13]

### Parts
C64  0.47uF  C-EUC0402-YVELTAL  [C0402]
C65  0.1uF  C-EUC0402-YVELTAL  [C0402]
R38  4.7k  R-EU_R0603  [R0603]
R39  PS0306DRF7T0R01L  [PS0306DRF7T0R01L]
R47  4.7k  R-EU_R0603  [R0603]
R53  4.7k  R-EU_R0603  [R0603]
U11  MAX17055ETB+T  [21-100013A_T102A2+1C_MXM]

### Nets
BAT: C65.1 U11.10(BATT) ; also sheet 5
CM4_3.3V(OUTPUT): R38.1 R47.1 R53.1 ; supply symbol labelled VSYS ; also sheet 1,2,7,8,11,12
GND: R39.1 ; also sheet 1,2,3,4,5,6,7,8,9,10,11,12,14
GPIO17_INT: R53.2 U11.8(ALRT) ; also sheet 2
N$30: C64.1 U11.7(REG)
N$32: R39.2 U11.5(CSN)
N$41: R39.3 U11.2(AIN) U11.6(CSP) U11.11(EPAD)
PK-: C64.2 C65.2 R39.4 ; also sheet 5
SCL1: R47.2 U11.3(SCL) ; also sheet 2,8
SDA1: R38.2 U11.4(SDA) ; also sheet 2,8
Unconnected: U11.1(N.C.) U11.9(THRM)

### Notes on the sheet
- 0.01Ω
- R39

## Sheet 14 of 14: Fan
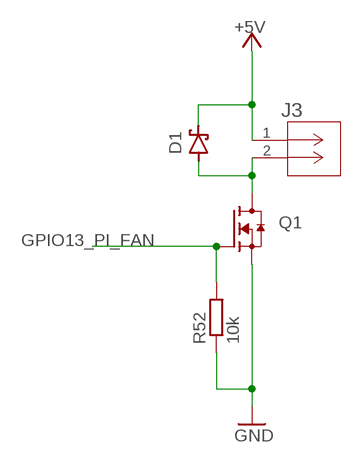
[diagram p13: schematic, sheet 14]

### Parts
D1  BAS70  [SOT23]
J3  2026560021  [CONN_2026560021_MOL]
Q1  AO3400A  [SOT95P280X125-3N]
R52  10k  R-EU_R0603  [R0603]

### Nets
+5V: D1.3(C) J3.1 ; supply symbol labelled VSYS ; also sheet 2,3,4,8,10,11,12
GND: Q1.2(S) R52.1 ; also sheet 1,2,3,4,5,6,7,8,9,10,11,12,13
GPIO13_PI_FAN: Q1.1(G) R52.2 ; also sheet 2
N$42: D1.1(A) J3.2 Q1.3(D)

## Library data of the parts
1-100 101-200 = DF40C-100DS-0.4V_51_:DF40C-100DS-0.4V(51): DF40 Series 100 Position Dual Row 0.4 mm Pitch Surface Mount Vertical Receptacle; DESCRIPTION: 100 Position Connector Receptacle, Center Strip Contacts Surface Mount Gold; DIGI-KEY_PART_NUMBER: H11615CT-ND; MF: Hirose; MP: DF40C-100DS-0.4V(51); PACKAGE: None; PURCHASE-URL: https://pricing.snapeda.com/search/part/DF40C-100DS-0.4V(51)/?ref=eda
3.3_SD_PWR +5V BT_DIS CM4_1.8V CM4_3.3V GLOBAL_EN GPIO14 GPIO15 LEDN NEXTRST NRPIBOOT RUN_PG TP1-TP4 WL_DIS = testpad:TP: Test pad
C1 C4 C23 C27-C29 C31 C56-C58 C69 = resistor:C-EU: CAPACITOR, European symbol
C2 C3 C5-C11 C20-C22 C24 C25 C32 C49-C54 C60 C61 C63 = microbuilder:CAP_CERAMIC: Ceramic Capacitors For new designs, use the packages preceded by an '_' character since they are more reliable: The following footprints should be used on most boards: _0402 - Standard footprint for regular board layouts _0603 - Standard footprint for regular board layouts _0805 - Standard footprint for regular board layouts _1206 - Standard footprint for regular board layouts For extremely tight-pitch boards where space is at a premium, the following 'micro-pitch' footprints can be used (smaller pads, no silkscreen outline, etc.): _0402MP - Micro-pitch footprint for very dense/compact boards _0603MP - Micro-pitch footprint for very dense/compact boards _0805MP - Micro-pitch footprint for very dense/compact boards _1206MP - Micro-pitch footprint for very dense/compact boards
C12-C19 C26 C30 C33-C36 C38-C40 C45 C48 C55 C62 C66 C67 = rcl:C-EU: CAPACITOR, European symbol; SPICEPREFIX: C
C37 JU_2-JU_6 R2 R10 R13 R15-R19 R22 R24 R36 R37 R42-R44 R48 R49 R52 = rcl:R-EU_: RESISTOR, European symbol; SPICEPREFIX: R
C41-C44 C47 C68 = SparkFun-Capacitors:1.0UF: 1µF ceramic capacitors A capacitor is a passive two-terminal electrical component used to store electrical energy temporarily in an electric field.; PROD_ID: CAP-00868
C46 C59 = SparkFun-Capacitors:1.0UF: 1µF ceramic capacitors A capacitor is a passive two-terminal electrical component used to store electrical energy temporarily in an electric field.; PROD_ID: CAP-11625; VALUE: 1.0uF
C64 C65 = rcl:C-EU: CAPACITOR, European symbol
D1 = diode:BAS70: Silicon Schottky Diodes General-purpose diode for high-speed switching
D2 = samacsys:ESDA25W: STMicroelectronics ESDA25W Dual Uni-Directional TVS Diode Array, 400W peak, 3-Pin SOT-323 Source: Datasheet <https://www.st.com/resource/en/datasheet/esdaxxxwx.pdf>; DESCRIPTION: STMicroelectronics ESDA25W Dual Uni-Directional TVS Diode Array, 400W peak, 3-Pin SOT-323; HEIGHT: 1.1mm; MANUFACTURER_NAME: STMicroelectronics; MANUFACTURER_PART_NUMBER: ESDA25W; MOUSER_PART_NUMBER: 511-ESDA25W; MOUSER_PRICE-STOCK: https://www.mouser.com/Search/Refine.aspx?Keyword=511-ESDA25W; RS_PART_NUMBER: 0250101; RS_PRICE-STOCK: http://uk.rs-online.com/web/p/products/0250101
D3 = samacsys:ESDA25P35-1U1M: STMicroelectronics ESDA25P35-1U1M, Uni-Directional TVS Diode, 1400W, 2-Pin QFN Source: Datasheet <https://www.st.com/resource/en/datasheet/esda25p35-1u1m.pdf>; DESCRIPTION: STMicroelectronics ESDA25P35-1U1M, Uni-Directional TVS Diode, 1400W, 2-Pin QFN; HEIGHT: 0mm; MANUFACTURER_NAME: STMicroelectronics; MANUFACTURER_PART_NUMBER: ESDA25P35-1U1M; MOUSER_PART_NUMBER: 511-ESDA25P35-1U1M; MOUSER_PRICE-STOCK: https://www.mouser.com/Search/Refine.aspx?Keyword=511-ESDA25P35-1U1M; RS_PART_NUMBER: 1639774P; RS_PRICE-STOCK: http://uk.rs-online.com/web/p/products/1639774P
D4 = samacsys:MBR0540T1G: 0.5A 40V Schottky Rectifier, MBR0540T1G ON Semiconductor MBR0540T1G Schottky Diode, 0.5A, 40V, 2-Pin SOD-123 Source: Datasheet <http://www.onsemi.com/pub/Collateral/MBR0540T1-D.PDF>; ALLIED_NUMBER: 70099497; ALLIED_PRICE-STOCK: http://www.alliedelec.com/on-semiconductor-mbr0540t1g/70099497/; DESCRIPTION: 0.5A 40V Schottky Rectifier, MBR0540T1G ON Semiconductor MBR0540T1G Schottky Diode, 0.5A, 40V, 2-Pin SOD-123; HEIGHT: 1.35mm; MANUFACTURER_NAME: ON Semiconductor; MANUFACTURER_PART_NUMBER: MBR0540T1G; MOUSER_PART_NUMBER: 863-MBR0540T1G; MOUSER_PRICE-STOCK: https://www.mouser.com/Search/Refine.aspx?Keyword=863-MBR0540T1G; RS_PART_NUMBER: 0463842P; RS_PRICE-STOCK: http://uk.rs-online.com/web/p/products/0463842P
FB1-FB4 = microbuilder:FERRITE: Ferrite Bead 0603 MMZ1608B121C - 120 Ohm @ 100MHz, 600mA, 0.15 Ohm DC Resistance - Digikey: 445-2164-1-ND BK1608HW121-T - 120 Ohm, 600mA Ferrite Chip - Digikey: 587-1876-2-ND 0805 HZ0805B272R-10 - 2.7K Ohm @ 100MHz, 200mA, 0.8 Ohm DC Resistance - Digikey: 240-2504-1-ND (see also Murata BLM21BD272SN1L) MMZ2012Y152B - 1.5K Ohm @ 100MHz, 500mA, 0.4 Ohm DC Resistance - Digikey: 445-1560-1-ND - Mainly for high frequency (80-400MHz) MMZ2012R102A - 1K Ohm @ 100MHz, 500mA, 0.3 Ohm DC Resistance - Digikey: 445-1555-2-ND - More general purpose (10-200MHz)
J1 = gustl_U262-161N-4BVC11:U262-161N-4BVC11
J2 = SJ-43516-SMT:SJ-43516-SMT: Conn 3.5MM Audio Jack F 6 POS Solder RA SMD 6 Terminal 1 Port; CUI_PURCHASE_URL: https://www.cuidevices.com/product/interconnect/connectors/audio-connectors/jacks/sj-4351x-smt-series?utm_source=snapeda.com&utm_medium=referral&utm_campaign=snapedaBOM; DESCRIPTION: 3.5 mm, 4 Conductors, Right Angle, Surface Mount (SMT), Audio Jack Connector; DIGI-KEY_PART_NUMBER: CP-43516SJCT-ND; MF: CUI Devices; MP: SJ-43516-SMT-TR; PACKAGE: None; PURCHASE-URL: https://pricing.snapeda.com/search/part/SJ-43516-SMT-TR/?ref=eda
J3 = 12401598E4_2A:2026560021; BUILT_BY: EMA_Cory; COPYRIGHT: Copyright (C) 2018 Accelerated Designs. All rights reserved; DATASHEET: https://www.digikey.com/product-detail/en/molex/2026560021/WM17360TR-ND/7964819; MANUFACTURER_PART_NUMBER: 2026560021; SOURCELIBRARY: Molex_2020-01-22; VENDOR: Molex Connector Corporation
J4 = 78171-0005:78171-0005: Pico-EZmate™ Wire-to-Board Header, Vertical, Housing Height: 1.55mm, with side-Friction Locks, 5 Circuits Check prices <https://pricing.snapeda.com/parts/78171-0005/Molex/view-part?ref=eda>; AVAILABILITY: In Stock; DESCRIPTION: Connector Header Surface Mount 5 position 0.047 (1.20mm); MF: Molex; MP: 78171-0005; PACKAGE: None; PRICE: None
J5 = 685119136923:685119136923: Mini Hdmi Conn, Rcpt, 19pos, r/a, Smt Check prices <https://pricing.snapeda.com/parts/685119136923/Wurth%20Electronics/view-part?ref=eda>; DESCRIPTION: HDMI - Mini Receptacle Connector 19 Position Surface Mount, Right Angle; Through Hole; MF: Wurth Electronics; MP: 685119136923; PACKAGE: None; PRICE: None; PURCHASE-URL: https://pricing.snapeda.com/search/part/685119136923/?ref=eda
J6 = 0781710004:0781710004: Connector Header Surface Mount 4 position 0.047in (1.20mm) Check availability <https://pricing.snapeda.com/parts/0781710004/Molex/view-part?ref=eda>; AVAILABILITY: In Stock; DESCRIPTION: Connector Header Surface Mount 4 position 0.047 (1.20mm); MF: Molex; MP: 0781710004; PACKAGE: None; PRICE: None; PURCHASE-URL: https://pricing.snapeda.com/search/part/0781710004/?ref=eda
L6 = LCD Driver:ASPI-0630HI
L8 = samacsys:VLCF4020T-220MR56: TDK VLCF4020 Series Shielded Wire-wound SMD Inductor 22 uH +/-20% 800mA Idc Source: Datasheet <https://product.tdk.com/info/en/catalog/datasheets/inductor_commercial_power_vlcf4020_en.pdf>; DESCRIPTION: TDK VLCF4020 Series Shielded Wire-wound SMD Inductor 22 uH +/-20% 800mA Idc; HEIGHT: mm; MANUFACTURER_NAME: TDK; MANUFACTURER_PART_NUMBER: VLCF4020T-220MR56; MOUSER_PART_NUMBER: 810-VLCF4020T220MR56; MOUSER_PRICE-STOCK: https://www.mouser.com/Search/Refine.aspx?Keyword=810-VLCF4020T220MR56; RS_PART_NUMBER: 6442781; RS_PRICE-STOCK: https://uk.rs-online.com/web/p/products/6442781
L+ L- R+ R- = testpad:TPS: TEST PIN
LEDN_ACT LEDN_PWR = led:LED: LED OSRAM: - CHIPLED LG R971, LG N971, LY N971, LG Q971, LY Q971, LO R971, LY R971 LH N974, LH R974 LS Q976, LO Q976, LY Q976 LO Q996 - Hyper CHIPLED LW Q18S LB Q993, LB Q99A, LB R99A - SideLED LS A670, LO A670, LY A670, LG A670, LP A670 LB A673, LV A673, LT A673, LW A673 LH A674 LY A675 LS A676, LA A676, LO A676, LY A676, LW A676 LS A679, LY A679, LG A679 - Hyper Micro SIDELED® LS Y876, LA Y876, LO Y876, LY Y876 LT Y87S - SmartLED LW L88C, LW L88S LB L89C, LB L89S, LG L890 LS L89K, LO L89K, LY L89K LS L896, LA L896, LO L896, LY L896 - TOPLED LS T670, LO T670, LY T670, LG T670, LP T670 LSG T670, LSP T670, LSY T670, LOP T670, LYG T670 LG T671, LOG T671, LSG T671 LB T673, LV T673, LT T673, LW T673 LH T674 LS T676, LA T676, LO T676, LY T676, LB T676, LH T676, LSB T676, LW T676 LB T67C, LV T67C, LT T67C, LS T67K, LO T67K, LY T67K, LW E67C LS E67B, LA E67B, LO E67B, LY E67B, LB E67C, LV E67C, LT E67C LW T67C LS T679, LY T679, LG T679 LS T770, LO T770, LY T770, LG T770, LP T770 LB T773, LV T773, LT T773, LW T773 LH T774 LS E675, LA E675, LY E675, LS T675 LS T776, LA T776, LO T776, LY T776, LB T776 LHGB T686 LT T68C, LB T68C - Hyper Mini TOPLED® LB M676 - Mini TOPLED Santana® LG M470 LS M47K, LO M47K, LY M47K Source: http://www.osram.convergy.de LUXEON: - LUMILED® LXK2-PW12-R00, LXK2-PW12-S00, LXK2-PW14-U00, LXK2-PW14-V00 LXK2-PM12-R00, LXK2-PM12-S00, LXK2-PM14-U00 LXK2-PE12-Q00, LXK2-PE12-R00, LXK2-PE12-S00, LXK2-PE14-T00, LXK2-PE14-U00 LXK2-PB12-K00, LXK2-PB12-L00, LXK2-PB12-M00, LXK2-PB14-N00, LXK2-PB14-P00, LXK2-PB14-Q00 LXK2-PR12-L00, LXK2-PR12-M00, LXK2-PR14-Q00, LXK2-PR14-R00 LXK2-PD12-Q00, LXK2-PD12-R00, LXK2-PD12-S00 LXK2-PH12-R00, LXK2-PH12-S00 LXK2-PL12-P00, LXK2-PL12-Q00, LXK2-PL12-R00 Source: www.luxeon.com KINGBRIGHT: KA-3528ASYC Source: www.kingbright.com
LEFTPCB RIGHTPCB = 1-1734839-4:1-1734839-4: Conn FPC Connector SKT 14 POS 0.5mm Solder RA SMD T/R; COMMENT: 1-1734839-4; DESCRIPTION: Conn FPC Connector SKT 14 POS 0.5mm Solder RA SMD T/R; DIGI-KEY_PART_NUMBER: A100295CT-ND; EU_ROHS_COMPLIANCE: Compliant; MF: TE Connectivity; MP: 1-1734839-4; PACKAGE: None; PURCHASE-URL: https://pricing.snapeda.com/search/part/1-1734839-4/?ref=eda
M-SD = 1140084168:1140084168: Conn; IC Socket; Micro SD; Right Angle; PCB Mount; MicroSD Ser.; DESCRIPTION: 10 (8 + 2) Position Card Connector Secure Digital - microSD™ Surface Mount, Right Angle Gold; DIGI-KEY_PART_NUMBER: 114-00841-68-1-ND; MF: Amphenol ICC (Commercial Products); MP: 114-00841-68; PACKAGE: None; PURCHASE-URL: https://pricing.snapeda.com/search/part/114-00841-68/?ref=eda
MICROSD_SWI = Personal:IC-RT9742
Q1-Q4 = AO3400A:AO3400A: Trans MOSFET N-CH 30V 5.7A 3-Pin SOT-23; DESCRIPTION: N-Channel 30V 5.7A (Ta) 1.4W (Ta) Surface Mount SOT-23-3L; DIGI-KEY_PART_NUMBER: 785-1000-1-ND; MF: Alpha &; MP: AO3400A; PACKAGE: SOT-23 Alpha &amp; Omega Semiconductor
R1 R6-R9 R12 R14 = microbuilder:RESISTOR_4PACK_US: Resistor Packs (4 resistors) 4 x 0603 10K 1/16W - Digikey: YC164J-10KCT-ND
R3 R4 = microbuilder:RESISTOR: Resistors For new designs, use the packages preceded by an '_' character since they are more reliable: The following footprints should be used on most boards: _0402 - Standard footprint for regular board layouts _0603 - Standard footprint for regular board layouts _0805 - Standard footprint for regular board layouts _1206 - Standard footprint for regular board layouts For extremely tight-pitch boards where space is at a premium, the following 'micro-pitch' footprints can be used (smaller pads, no silkscreen outline, etc.): _0402MP - Micro-pitch footprint for very dense/compact boards _0603MP - Micro-pitch footprint for very dense/compact boards _0805MP - Micro-pitch footprint for very dense/compact boards _1206MP - Micro-pitch footprint for very dense/compact boards
R5 R11 R20 R21 R23 R31-R34 R38 R41 R45-R47 R53-R56 = resistor:R-EU_: RESISTOR, European symbol
R25 R27-R29 R40 = SparkFun-Resistors:100KOHM: 100kΩ resistor A resistor is a passive two-terminal electrical component that implements electrical resistance as a circuit element. Resistors act to reduce current flow, and, at the same time, act to lower voltage levels within circuits. - Wikipedia; PROD_ID: RES-07828; VALUE: 100k
R26 R30 R35 = resistor:R-US_: RESISTOR, American symbol
R39 = 12401598E4_2A:PS0306DRF7T0R01L
SJ3 = microbuilder:SOLDERJUMPER: SMD Solder JUMPER Solder the two pads together to create a connection, or remove the solder to break it. REFLOW - Use this footprint for solder paste and reflow ovens. WAVE - Use this footprint for hand-soldering (larger pads). CLOSED - Has a trace between the two pads to ensure it is closed by default. The trace needs to be cut to disable the jumper, and can be closed again by creating a solder bridge between the two pads.; BOM: EXCLUDE
U1 = microbuilder:TFP401: TFP401 PanelBus Digital Receiver Supports Pixel Rates Up to 165 MHz (Including 1080p and WUXGA at 60Hz) Supply Voltage: 3.0-3.6V Operating Temperature: 0-70°C (EP version exists with -55-125°C)
U2 = microbuilder:EEPROM_I2C_MCP24AA32: Microchip 32K (4K x 8) 1.8V I2C EEPROM SOT23-5 [Digikey: 24AA32AFT-I/OTCT-ND]
U3 = s62684-402100alf (1):S62684-402100ALF
U4 = TS3USB221A:TS3USB221A: DPDT Analog Mux Vcc 2.5 to 3.3V Passes up to 5.5V at 3.3V supply 900MHz BW, 6Ω switch resistance; AVAILABILITY: Unavailable; DESCRIPTION: ESD Protected High-Speed USB 2.0 _480-Mbps_ 1: 2 Multiplexer/Demultiplexer Switch; MF: Texas Instruments; MP: TS3USB221A; PACKAGE: None; PRICE: None
U5 = samacsys:BQ24292I
U6 = QFN50P500X500X100-33N:WM8960
U7 = IP2721:IP2721: IC DRIVER 4/0 16TSSOP Manufacturer's datasheet <https://media.digikey.com/pdf/Data%20Sheets/Fairchild%20PDFs/FIN1031.pdf>; CREATED_BY: PCBLayout.com; DIGIKEY_PN: FIN1031MTCXTR-ND; MANUFACTURER: ON Semiconductor; MPN: FIN1031MTCX; PACKAGE: TSSOP-16
U8 = samacsys:TPS61230DRCT: Voltage Regulators - Switching Regulators HE Sync Boost Converter Source: Datasheet <http://www.ti.com/lit/ds/symlink/tps61230.pdf>; DESCRIPTION: Voltage Regulators - Switching Regulators HE Sync Boost Converter; HEIGHT: 1mm; MANUFACTURER_NAME: Texas Instruments; MANUFACTURER_PART_NUMBER: TPS61230DRCT; MOUSER_PART_NUMBER: 595-TPS61230DRCT; MOUSER_PRICE-STOCK: https://www.mouser.com/Search/Refine.aspx?Keyword=595-TPS61230DRCT
U9 = 5025700893:USB2422T/MJ; BUILT_BY: EMA_April; COPYRIGHT: Copyright (C) 2018 Accelerated Designs. All rights reserved; MANUFACTURER_PART_NUMBER: USB2422T/MJ; SOURCELIBRARY: Microchip_2019-08-23_16; VENDOR: Microchip
U10 U12 U13 = Semtech RClamp0582B:RCLAMP0582BQTCT; BUILT_BY: EMA_Justin; COPYRIGHT: Copyright (C) 2018 Accelerated Designs. All rights reserved; MANUFACTURER_PART_NUMBER: RCLAMP0582BQTCT; SOURCELIBRARY: Semtech_2019-11-26; VENDOR: Semtech Corporation
U11 = My_Stuff:MAX17055ETB+T; BUILT_BY: EMA_UL_Team; COPYRIGHT: Copyright (C) 2018 Accelerated Designs. All rights reserved; MANUFACTURER_PART_NUMBER: MAX17055ETB+T; REVISION: 1; SOURCELIBRARY: Maxim_2018-11-30; VENDOR: Maxim Integrated Products
U14 = MCU-ATTINY84A-MU_QFN20_:MCU-ATTINY84A-MU(QFN20): 310010131 Check prices <https://pricing.snapeda.com/parts/ATTINY84A-MU/Microchip%20Technology/view-part?ref=eda>; AVAILABILITY: Good; DESCRIPTION: AVR AVR® ATtiny Microcontroller IC 8-Bit 20MHz 8KB (4K x 16) FLASH 20-QFN-EP (4x4); MF: Microchip Technology; MP: ATTINY84A-MU; PACKAGE: WFQFN-20 Microchip; PRICE: None; PURCHASE-URL: https://pricing.snapeda.com/search/part/ATTINY84A-MU/?ref=eda
U15 = SOT65P210X110-6N:TPS22948
U16 = bq25895:TPS82085
U17 = samacsys:TPS61160ADRVT: White LED Driver with PWM Brightness Control in 2mm x 2mm Package. Up to 10 LEDs in Series Source: Datasheet <http://www.ti.com/lit/ds/symlink/tps61160a.pdf>; DESCRIPTION: White LED Driver with PWM Brightness Control in 2mm x 2mm Package. Up to 10 LEDs in Series; HEIGHT: 0.8mm; MANUFACTURER_NAME: Texas Instruments; MANUFACTURER_PART_NUMBER: TPS61160ADRVT; MOUSER_PART_NUMBER: 595-TPS61160ADRVT; MOUSER_PRICE-STOCK: https://www.mouser.com/Search/Refine.aspx?Keyword=595-TPS61160ADRVT; RS_PART_NUMBER: 7099044P; RS_PRICE-STOCK: http://uk.rs-online.com/web/p/products/7099044P
U18 = Wii PMS:INDUCTOR_SMALL
U19 U20 = SN74LVC1G17DCKR:SN74LVC1G17DCKR: Check prices <https://pricing.snapeda.com/parts/SN74LVC1G17DCKR/Texas%20Instruments/view-part?ref=eda>; AVAILABILITY: In Stock; DESCRIPTION: Single Schmitt-Trigger Buffer 5-SC70 -40 to 125; MF: Texas Instruments; MP: SN74LVC1G17DCKR; PACKAGE: SOT-SC70-5 Texas Instruments; PRICE: None; PURCHASE-URL: https://pricing.snapeda.com/search/part/SN74LVC1G17DCKR/?ref=eda
U22 = Personal:BUF-74LVC1G07
U$29 = My_Stuff:1MM_PIC_PROGRAMING_HEADER
Y1 = ECS-3225MV-240-BN-TR:ECS-3225MV-240-BN-TR: subminiature SMD oscillators.; DESCRIPTION: 24MHz XO (Standard) HCMOS Oscillator 1.62V ~ 3.63V Enable/Disable 4-SMD, No Lead; DIGI-KEY_PART_NUMBER: XC2876CT-ND; MF: ECS Inc.; MP: ECS-3225MV-240-BN-TR; PACKAGE: SMD-4 ECS International; PURCHASE-URL: https://pricing.snapeda.com/search/part/ECS-3225MV-240-BN-TR/?ref=eda
Y2 = ECS-240-8-36CKM-TR:ECS-240-8-36CKM-TR: The minature ECS-160-10-36-JGN-TR is a compact SMD Crystal. The industry standard 2.5 x 2.0 x 0.55 mm ceramic package is ideal for today’s SMD manufacturing environment.; DESCRIPTION: 24MHz ±10ppm Crystal 8pF 60 Ohms 4-SMD, No Lead; DIGI-KEY_PART_NUMBER: XC1557CT-ND; MF: ECS Inc.; MP: ECS-240-8-36CKM-TR; PACKAGE: SMD-4 ECS International; PURCHASE-URL: https://pricing.snapeda.com/search/part/ECS-240-8-36CKM-TR/?ref=eda

## Net classes
1 USB 2.0 Differential Pair: width 0.192 mm, clearance 0.114 mm
2 HDMI: width 0.126 mm, clearance 0.102 mm